# Altium project S7CAS-PLEIADES-CARTE-MERE_Pxx.PrjPcb (part 1 of 3)
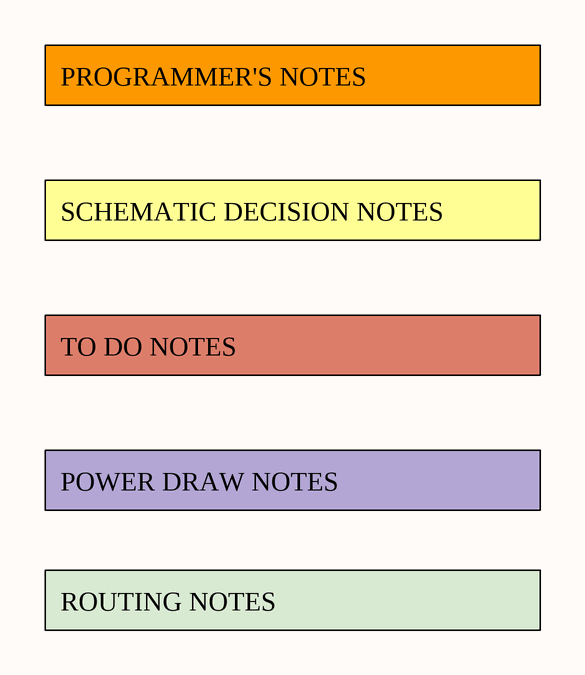
[diagram p0: S7CAS-PLEIADES-CARTE-MERE_Pxx_OVERVIEW.SchDoc]
Project_Date: 2024-01-30; Project_Designer1: Julien Guay; Project_Designer2: Brahim Khalil Tekil; Project_Global: PLEIADES; Project_Group: P15; Project_Name: PLEIADES MOTHERBOARD; Project_Revision: 1.00
11 sheets, 404 parts. Net scope: flat (ports and power ports of the same name join across sheets).
Board file: S7CAS-PLEIADES-CARTE-MERE_Pxx.PcbDoc
Sheets:
  S7CAS-PLEIADES-CARTE-MERE_Pxx_TITLE.SchDoc
  S7CAS-PLEIADES-CARTE-MERE_Pxx_OVERVIEW.SchDoc
  S7CAS-PLEIADES-CARTE-MERE_Pxx_FPGA_bank0_1_5.SchDoc
  S7CAS-PLEIADES-CARTE-MERE_Pxx_DDR.SchDoc
  S7CAS-PLEIADES-CARTE-MERE_Pxx_DEBUG_USB.SchDoc
  S7CAS-PLEIADES-CARTE-MERE_Pxx_PHY.SchDoc
  S7CAS-PLEIADES-CARTE-MERE_Pxx_FLASH_PHY_CLOCK.SchDoc
  S7CAS-PLEIADES-CARTE-MERE_Pxx_CAN.SchDoc
  S7CAS-PLEIADES-CARTE-MERE_Pxx_IO_SENSOR.SchDoc
  S7CAS-PLEIADES-CARTE-MERE_Pxx_ARBRE_CAP_ARBRE.SchDoc
  S7CAS-PLEIADES-CARTE-MERE_TO_BE_DELETED.SchDoc

## Sheet S7CAS-PLEIADES-CARTE-MERE_Pxx_TITLE.SchDoc
size Tabloid; SheetNumber: 1; SheetTotal: 15; Sheet_Name: PLEIADES MOTHERBOARD; Size: 11x17

### Notes on the sheet
- Revision history
- Package size conversion
- Metric
- 1005
- 1608
- Imperial
- 0402
- 0603
- Revision
- 2012
- 3216
- 0805
- 1206
- 3225
- 6432
- 1210
- 2512
- Date :
- Project Title
- Global Project
- Size
- Group
- Date
- Sheet
- of
- Filename
- Designers

## Sheet S7CAS-PLEIADES-CARTE-MERE_Pxx_OVERVIEW.SchDoc
size Tabloid; SheetNumber: 2; SheetTotal: 18; Sheet_Name: OVERVIEW; Size: 11x17

### Notes on the sheet
- PROGRAMMER'S NOTES
- SCHEMATIC DECISION NOTES
- TO DO NOTES
- POWER DRAW NOTES
- ROUTING NOTES
- Sheet Name
- Project Title
- Global Project
- Size
- Group
- Revision
- Date
- Sheet
- of
- Filename
- Designers

## Sheet S7CAS-PLEIADES-CARTE-MERE_Pxx_FPGA_bank0_1_5.SchDoc
size Tabloid; Date: Date; Author: Author 1; Revision: 1; SheetNumber: 3; SheetTotal: 18; Size: 11x17; Sheet_Name: BANK 0, 1 & 5
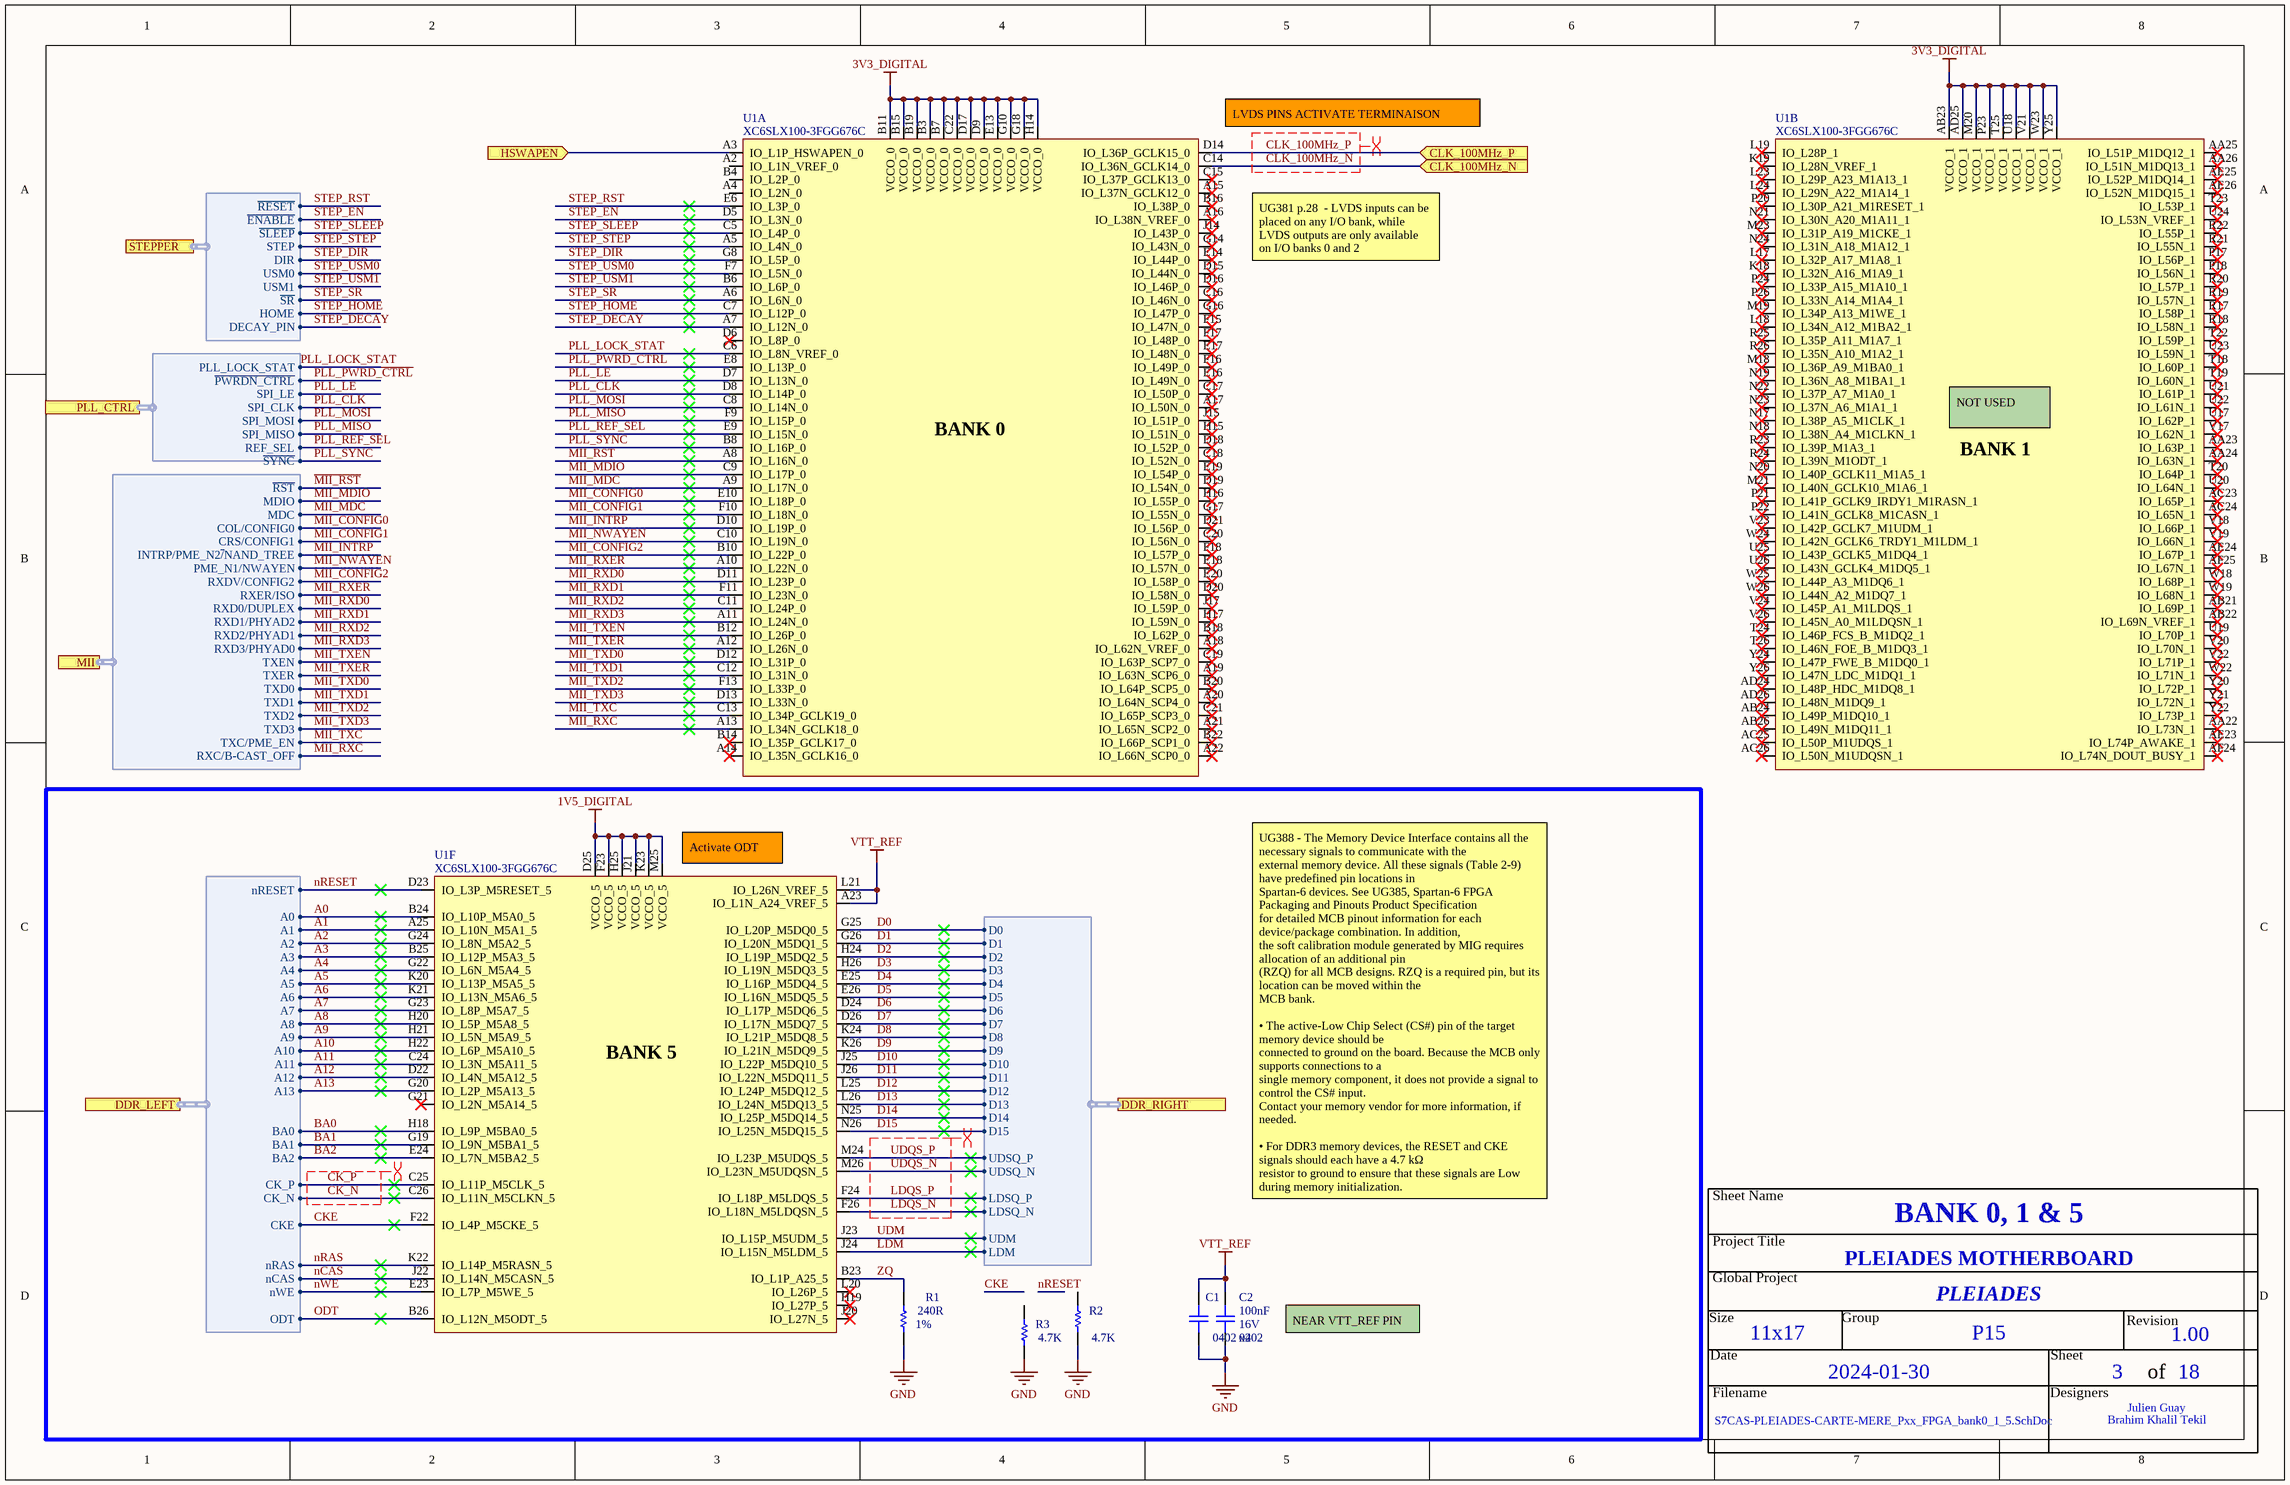
[diagram p1: S7CAS-PLEIADES-CARTE-MERE_Pxx_FPGA_bank0_1_5.SchDoc]

### Parts
C1  0402  [CAP_0402]
C2  value 100nF  Voltage: 16V  [CAP_0402]  (hidden comment: 0402)
R1  value 240R  Precision: 1%  [RES_0402]  (hidden comment: RES - 0603)
R2  value 4.7K  [RES_0402]  (hidden comment: RES - 0603)
R3  value 4.7K  [RES_0402]  (hidden comment: RES - 0603)
U1  XC6SLX100-3FGG676C  [FPGA_XILINX_FGG676]  (parts A,B,F of 10)

### Blocks framed on the sheet
x2: C1 C2 R1-R3 U1

### Ports
CLK_100MHz_N (in, see S7CAS-PLEIADES-CARTE-MERE_Pxx_FLASH_PHY_CLOCK[5A]), CLK_100MHz_P (in, see S7CAS-PLEIADES-CARTE-MERE_Pxx_FLASH_PHY_CLOCK[5A]), DDR_LEFT (harness ddr_left, see S7CAS-PLEIADES-CARTE-MERE_Pxx_DDR[1B]), DDR_RIGHT (harness ddr_right, see S7CAS-PLEIADES-CARTE-MERE_Pxx_DDR[4B]), HSWAPEN (in, see S7CAS-PLEIADES-CARTE-MERE_Pxx_FPGA_bank2_4[1D]), MII (harness MII - Harness, see S7CAS-PLEIADES-CARTE-MERE_Pxx_PHY[1C]), PLL_CTRL (harness PLL_CTRL, see S7CAS-PLEIADES-CARTE-MERE_Pxx_FLASH_PHY_CLOCK[2B]), STEPPER (harness STEPPER_MOTOR_DRIVER_HARNESS, see S7CAS-PLEIADES-CARTE-MERE_Pxx_MOTEUR[4B])

### Harnesses
ddr_left: ODT, nRAS, nCAS, nWE, CKE, CK_P, CK_N, BA0, BA1, BA2, A0, A1, A2, A3, A4, A5, A6, A7, A8, A9, A10, A11, A12, A13, nRESET
ddr_right: D0, D1, D2, D3, D4, D5, D6, D7, D8, D9, D10, D11, D12, D13, D14, D15, UDSQ_P, UDSQ_N, LDSQ_N, LDSQ_P, UDM, LDM
MII - Harness: ~{RST}, MDIO, MDC, COL/CONFIG0, CRS/CONFIG1, INTRP/PME_N2~{/}NAND_TREE, PME_N1/NWAYEN, RXDV/CONFIG2, RXER/ISO, RXD0/DUPLEX, RXD1/PHYAD2, RXD2/PHYAD1, RXD3/PHYAD0, RXC/B-CAST_OFF, TXEN, TXER, TXD0, TXD1, TXD2, TXD3, TXC/PME_EN
PLL_CTRL: ~{PWRDN_CTRL}, SPI_LE, SPI_CLK, SPI_MOSI, SPI_MISO, REF_SEL, ~{SYNC}, PLL_LOCK_STAT
STEPPER_MOTOR_DRIVER_HARNESS: ~{RESET}, ~{ENABLE}, ~{SLEEP}, STEP, DIR, USM0, USM1, ~{SR}, HOME, DECAY_PIN

### Nets
1V5_DIGITAL: U1.D25(VCCO_5) U1.F23(VCCO_5) U1.H25(VCCO_5) U1.J21(VCCO_5) U1.K23(VCCO_5) U1.M25(VCCO_5)
3V3_DIGITAL: U1.AB23(VCCO_1) U1.AD25(VCCO_1) U1.B3(VCCO_0) U1.B7(VCCO_0) U1.B11(VCCO_0) U1.B15(VCCO_0) U1.B19(VCCO_0) U1.C22(VCCO_0) U1.D9(VCCO_0) U1.D17(VCCO_0) U1.E13(VCCO_0) U1.G10(VCCO_0) U1.G18(VCCO_0) U1.H14(VCCO_0) U1.M20(VCCO_1) U1.P23(VCCO_1) U1.T25(VCCO_1) U1.U18(VCCO_1) U1.V21(VCCO_1) U1.W23(VCCO_1) U1.Y25(VCCO_1)
GND: C1.1 C2.1 R1.1 R2.1 R3.1
VTT_REF: C1.2 C2.2 U1.A23(IO_L1N_A24_VREF_5) U1.L21(IO_L26N_VREF_5)
~{MII_RST}: U1.A8(IO_L16N_0) ; port MII.~{RST}
~{PLL_PWRD_CTRL}: U1.E8(IO_L13P_0) ; port PLL_CTRL.~{PWRDN_CTRL}
~{PLL_SYNC}: U1.B8(IO_L16P_0) ; port PLL_CTRL.~{SYNC}
~{STEP_EN}: U1.D5(IO_L3N_0) ; port STEPPER.~{ENABLE}
~{STEP_SR}: U1.A6(IO_L6N_0) ; port STEPPER.~{SR}
A0: U1.B24(IO_L10P_M5A0_5) ; port DDR_LEFT.A0
A1: U1.A25(IO_L10N_M5A1_5) ; port DDR_LEFT.A1
A2: U1.G24(IO_L8N_M5A2_5) ; port DDR_LEFT.A2
A3: U1.B25(IO_L12P_M5A3_5) ; port DDR_LEFT.A3
A4: U1.G22(IO_L6N_M5A4_5) ; port DDR_LEFT.A4
A5: U1.K20(IO_L13P_M5A5_5) ; port DDR_LEFT.A5
A6: U1.K21(IO_L13N_M5A6_5) ; port DDR_LEFT.A6
A7: U1.G23(IO_L8P_M5A7_5) ; port DDR_LEFT.A7
A8: U1.H20(IO_L5P_M5A8_5) ; port DDR_LEFT.A8
A9: U1.H21(IO_L5N_M5A9_5) ; port DDR_LEFT.A9
A10: U1.H22(IO_L6P_M5A10_5) ; port DDR_LEFT.A10
A11: U1.C24(IO_L3N_M5A11_5) ; port DDR_LEFT.A11
A12: U1.D22(IO_L4N_M5A12_5) ; port DDR_LEFT.A12
A13: U1.G20(IO_L2P_M5A13_5) ; port DDR_LEFT.A13
BA0: U1.H18(IO_L9P_M5BA0_5) ; port DDR_LEFT.BA0
BA1: U1.G19(IO_L9N_M5BA1_5) ; port DDR_LEFT.BA1
BA2: U1.E24(IO_L7N_M5BA2_5) ; port DDR_LEFT.BA2
CK_N: U1.C26(IO_L11N_M5CLKN_5) ; port DDR_LEFT.CK_N
CK_P: U1.C25(IO_L11P_M5CLK_5) ; port DDR_LEFT.CK_P
CKE: U1.F22(IO_L4P_M5CKE_5) ; port DDR_LEFT.CKE
CLK_100MHz_N: U1.C14(IO_L36N_GCLK14_0) ; port CLK_100MHz_N
CLK_100MHz_P: U1.D14(IO_L36P_GCLK15_0) ; port CLK_100MHz_P
D0: U1.G25(IO_L20P_M5DQ0_5) ; port DDR_RIGHT.D0
D1: U1.G26(IO_L20N_M5DQ1_5) ; port DDR_RIGHT.D1
D2: U1.H24(IO_L19P_M5DQ2_5) ; port DDR_RIGHT.D2
D3: U1.H26(IO_L19N_M5DQ3_5) ; port DDR_RIGHT.D3
D4: U1.E25(IO_L16P_M5DQ4_5) ; port DDR_RIGHT.D4
D5: U1.E26(IO_L16N_M5DQ5_5) ; port DDR_RIGHT.D5
D6: U1.D24(IO_L17P_M5DQ6_5) ; port DDR_RIGHT.D6
D7: U1.D26(IO_L17N_M5DQ7_5) ; port DDR_RIGHT.D7
D8: U1.K24(IO_L21P_M5DQ8_5) ; port DDR_RIGHT.D8
D9: U1.K26(IO_L21N_M5DQ9_5) ; port DDR_RIGHT.D9
D10: U1.J25(IO_L22P_M5DQ10_5) ; port DDR_RIGHT.D10
D11: U1.J26(IO_L22N_M5DQ11_5) ; port DDR_RIGHT.D11
D12: U1.L25(IO_L24P_M5DQ12_5) ; port DDR_RIGHT.D12
D13: U1.L26(IO_L24N_M5DQ13_5) ; port DDR_RIGHT.D13
D14: U1.N25(IO_L25P_M5DQ14_5) ; port DDR_RIGHT.D14
D15: U1.N26(IO_L25N_M5DQ15_5) ; port DDR_RIGHT.D15
HSWAPEN: U1.A3(IO_L1P_HSWAPEN_0) ; port HSWAPEN
LDM: U1.J24(IO_L15N_M5LDM_5) ; port DDR_RIGHT.LDM
LDQS_N: U1.F26(IO_L18N_M5LDQSN_5) ; port DDR_RIGHT.LDSQ_N
LDQS_P: U1.F24(IO_L18P_M5LDQS_5) ; port DDR_RIGHT.LDSQ_P
MII_CONFIG0: U1.E10(IO_L18P_0) ; port MII.COL/CONFIG0  [project net COL]
MII_CONFIG1: U1.F10(IO_L18N_0) ; port MII.CRS/CONFIG1  [project net CRS]
MII_CONFIG2: U1.B10(IO_L22P_0) ; port MII.RXDV/CONFIG2
MII_INTRP: U1.D10(IO_L19P_0) ; port MII.INTRP/PME_N2~{/}NAND_TREE  [project net INTRP]
MII_MDC: U1.A9(IO_L17N_0) ; port MII.MDC  [project net MDC]
MII_MDIO: U1.C9(IO_L17P_0) ; port MII.MDIO  [project net MDIO]
MII_NWAYEN: U1.C10(IO_L19N_0) ; port MII.PME_N1/NWAYEN
MII_RXC: U1.A13(IO_L34N_GCLK18_0) ; port MII.RXC/B-CAST_OFF
MII_RXD0: U1.D11(IO_L23P_0) ; port MII.RXD0/DUPLEX
MII_RXD1: U1.F11(IO_L23N_0) ; port MII.RXD1/PHYAD2
MII_RXD2: U1.C11(IO_L24P_0) ; port MII.RXD2/PHYAD1
MII_RXD3: U1.A11(IO_L24N_0) ; port MII.RXD3/PHYAD0
MII_RXER: U1.A10(IO_L22N_0) ; port MII.RXER/ISO
MII_TXC: U1.C13(IO_L34P_GCLK19_0) ; port MII.TXC/PME_EN
MII_TXD0: U1.D12(IO_L31P_0) ; port MII.TXD0
MII_TXD1: U1.C12(IO_L31N_0) ; port MII.TXD1
MII_TXD2: U1.F13(IO_L33P_0) ; port MII.TXD2
MII_TXD3: U1.D13(IO_L33N_0) ; port MII.TXD3
MII_TXEN: U1.B12(IO_L26P_0) ; port MII.TXEN
MII_TXER: U1.A12(IO_L26N_0) ; port MII.TXER
nCAS: U1.J22(IO_L14N_M5CASN_5) ; port DDR_LEFT.nCAS
nRAS: U1.K22(IO_L14P_M5RASN_5) ; port DDR_LEFT.nRAS
nRESET: U1.D23(IO_L3P_M5RESET_5) ; port DDR_LEFT.nRESET
nWE: U1.E23(IO_L7P_M5WE_5) ; port DDR_LEFT.nWE
ODT: U1.B26(IO_L12N_M5ODT_5) ; port DDR_LEFT.ODT
PLL_CLK: U1.D8(IO_L14P_0) ; port PLL_CTRL.SPI_CLK
PLL_LE: U1.D7(IO_L13N_0) ; port PLL_CTRL.SPI_LE
PLL_LOCK_STAT: U1.C6(IO_L8N_VREF_0) ; port PLL_CTRL.PLL_LOCK_STAT
PLL_MISO: U1.F9(IO_L15P_0) ; port PLL_CTRL.SPI_MISO
PLL_MOSI: U1.C8(IO_L14N_0) ; port PLL_CTRL.SPI_MOSI
PLL_REF_SEL: U1.E9(IO_L15N_0) ; port PLL_CTRL.REF_SEL
STEP_DECAY: U1.A7(IO_L12N_0) ; port STEPPER.DECAY_PIN
STEP_DIR: U1.G8(IO_L5P_0) ; port STEPPER.DIR
STEP_HOME: U1.C7(IO_L12P_0) ; port STEPPER.HOME
STEP_RST: U1.E6(IO_L3P_0) ; port STEPPER.~{RESET}
STEP_SLEEP: U1.C5(IO_L4P_0) ; port STEPPER.~{SLEEP}
STEP_STEP: U1.A5(IO_L4N_0) ; port STEPPER.STEP
STEP_USM0: U1.F7(IO_L5N_0) ; port STEPPER.USM0
STEP_USM1: U1.B6(IO_L6P_0) ; port STEPPER.USM1
UDM: U1.J23(IO_L15P_M5UDM_5) ; port DDR_RIGHT.UDM
UDQS_N: U1.M26(IO_L23N_M5UDQSN_5) ; port DDR_RIGHT.UDSQ_N
UDQS_P: U1.M24(IO_L23P_M5UDQS_5) ; port DDR_RIGHT.UDSQ_P
ZQ: R1.2 U1.B23(IO_L1P_A25_5)

Not connected (* = marked no-connect by the designer): R2 2; R3 2; U1 A2(IO_L1N_VREF_0) A4(IO_L2N_0) A14(IO_L35N_GCLK16_0)* A15(IO_L37N_GCLK12_0)* A16(IO_L38N_VREF_0)* A17(IO_L50N_0)* A18(IO_L62N_VREF_0)* A19(IO_L63N_SCP6_0)* A20(IO_L64N_SCP4_0)* A21(IO_L65N_SCP2_0)* A22(IO_L66N_SCP0_0)* AA22(IO_L73N_1)* AA23(IO_L63P_1)* AA24(IO_L63N_1)* AA25(IO_L51P_M1DQ12_1)* AA26(IO_L51N_M1DQ13_1)* AB21(IO_L69P_1)* AB22(IO_L69N_VREF_1)* AB24(IO_L49P_M1DQ10_1)* AB26(IO_L49N_M1DQ11_1)* AC23(IO_L65P_1)* AC24(IO_L65N_1)* AC25(IO_L50P_M1UDQS_1)* AC26(IO_L50N_M1UDQSN_1)* AD24(IO_L48P_HDC_M1DQ8_1)* AD26(IO_L48N_M1DQ9_1)* AE23(IO_L74P_AWAKE_1)* AE24(IO_L67P_1)* AE25(IO_L52P_M1DQ14_1)* AE26(IO_L52N_M1DQ15_1)* AF24(IO_L74N_DOUT_BUSY_1)* AF25(IO_L67N_1)* B4(IO_L2P_0) B14(IO_L35P_GCLK17_0)* B16(IO_L38P_0)* B18(IO_L62P_0)* B20(IO_L64P_SCP5_0)* B22(IO_L66P_SCP1_0)* C15(IO_L37P_GCLK13_0)* C16(IO_L46N_0)* C17(IO_L50P_0)* C18(IO_L52N_0)* C19(IO_L63P_SCP7_0)* C20(IO_L56N_0)* C21(IO_L65P_SCP3_0)* D6(IO_L8P_0)* D15(IO_L44N_0)* D16(IO_L46P_0)* D18(IO_L52P_0)* D19(IO_L54N_0)* D20(IO_L58N_0)* D21(IO_L56P_0)* E14(IO_L44P_0)* E16(IO_L49N_0)* E17(IO_L48N_0)* E18(IO_L57N_0)* E19(IO_L54P_0)* E20(IO_L58P_0)* F15(IO_L47N_0)* F16(IO_L49P_0)* F17(IO_L48P_0)* F18(IO_L57P_0)* G14(IO_L43N_0)* G16(IO_L47P_0)* G17(IO_L55N_0)* G21(IO_L2N_M5A14_5)* H15(IO_L51N_0)* H16(IO_L55P_0)* H17(IO_L59N_0)* H19(IO_L27P_5)* J14(IO_L43P_0)* J15(IO_L51P_0)* J17(IO_L59P_0)* J20(IO_L27N_5)* K18(IO_L32N_A16_M1A9_1)* K19(IO_L28N_VREF_1)* L17(IO_L32P_A17_M1A8_1)* L18(IO_L34N_A12_M1BA2_1)* L19(IO_L28P_1)* L20(IO_L26P_5)* L23(IO_L29P_A23_M1A13_1)* L24(IO_L29N_A22_M1A14_1)* M18(IO_L36P_A9_M1BA0_1)* M19(IO_L34P_A13_M1WE_1)* M21(IO_L40N_GCLK10_M1A6_1)* M23(IO_L31P_A19_M1CKE_1)* N17(IO_L38P_A5_M1CLK_1)* N18(IO_L38N_A4_M1CLKN_1)* N19(IO_L36N_A8_M1BA1_1)* N20(IO_L40P_GCLK11_M1A5_1)* N21(IO_L30N_A20_M1A11_1)* N22(IO_L37P_A7_M1A0_1)* N23(IO_L37N_A6_M1A1_1)* N24(IO_L31N_A18_M1A12_1)* P17(IO_L56P_1)* P18(IO_L56N_1)* P20(IO_L30P_A21_M1RESET_1)* P21(IO_L41P_GCLK9_IRDY1_M1RASN_1)* P22(IO_L41N_GCLK8_M1CASN_1)* P24(IO_L33P_A15_M1A10_1)* P26(IO_L33N_A14_M1A4_1)* R17(IO_L58P_1)* R18(IO_L58N_1)* R19(IO_L57N_1)* R20(IO_L57P_1)* R21(IO_L55N_1)* R22(IO_L55P_1)* R23(IO_L39P_M1A3_1)* R24(IO_L39N_M1ODT_1)* R25(IO_L35P_A11_M1A7_1)* R26(IO_L35N_A10_M1A2_1)* T18(IO_L60P_1)* T19(IO_L60N_1)* T20(IO_L64P_1)* T22(IO_L59P_1)* T23(IO_L53P_1)* T24(IO_L46P_FCS_B_M1DQ2_1)* T26(IO_L46N_FOE_B_M1DQ3_1)* U17(IO_L62P_1)* U19(IO_L70P_1)* U20(IO_L64N_1)* U21(IO_L61P_1)* U22(IO_L61N_1)* U23(IO_L59N_1)* U24(IO_L53N_VREF_1)* U25(IO_L43P_GCLK5_M1DQ4_1)* U26(IO_L43N_GCLK4_M1DQ5_1)* V17(IO_L62N_1)* V18(IO_L66P_1)* V19(IO_L66N_1)* V20(IO_L70N_1)* V22(IO_L71P_1)* V23(IO_L42P_GCLK7_M1UDM_1)* V24(IO_L45P_A1_M1LDQS_1)* V26(IO_L45N_A0_M1LDQSN_1)* W18(IO_L68P_1)* W19(IO_L68N_1)* W22(IO_L71N_1)* W24(IO_L42N_GCLK6_TRDY1_M1LDM_1)* W25(IO_L44P_A3_M1DQ6_1)* W26(IO_L44N_A2_M1DQ7_1)* Y20(IO_L72P_1)* Y21(IO_L72N_1)* Y22(IO_L73P_1)* Y24(IO_L47P_FWE_B_M1DQ0_1)* Y26(IO_L47N_LDC_M1DQ1_1)*

### Layout directives
differential pair; differential pair class DDR_CK_PAIR: CK_N, CK_P
differential pair; differential pair class DQS_DIFF_PAIR: LDQS_N, LDQS_P, UDQS_N, UDQS_P
differential pair; differential pair class CLK_100MHz_PAIR: CLK_100MHz_N, CLK_100MHz_P

### Notes on the sheet
- (near U1) LVDS PINS ACTIVATE TERMINAISON
- UG381 p.28  - LVDS inputs can be placed on any I/O bank, while
  LVDS outputs are only available on I/O banks 0 and 2
- (near U1) NOT USED
- (near U1) Activate ODT
- UG388 - The Memory Device Interface contains all the necessary signals to communicate with the
  external memory device. All these signals (Table 2-9) have predefined pin locations in
  Spartan-6 devices. See UG385, Spartan-6 FPGA Packaging and Pinouts Product Specification
  for detailed MCB pinout information for each device/package combination. In addition,
  the soft calibration module generated by MIG requires allocation of an additional pin
  (RZQ) for all MCB designs. RZQ is a required pin, but its location can be moved within the
  MCB bank.
  • The active-Low Chip Select (CS#) pin of the target memory device should be
  connected to ground on the board. Because the MCB only supports connections to a
  single memory component, it does not provide a signal to control the CS# input.
  Contact your memory vendor for more information, if needed.
  • For DDR3 memory devices, the RESET and CKE signals should each have a 4.7 kΩ
  resistor to ground to ensure that these signals are Low during memory initialization.
- NEAR VTT_REF PIN
- Sheet Name
- Project Title
- Global Project
- Revision
- Size
- Date
- Group
- Sheet
- of
- Filename
- Designers
- (in symbol FPGA_XC6SLX100-3FGG676C, part A) BANK 0
- (in symbol FPGA_XC6SLX100-3FGG676C, part B) BANK 1
- (in symbol FPGA_XC6SLX100-3FGG676C, part F) BANK 5

### Library data of the parts
C1 = CAP - 0603: CAP - 0402; Precision: 10%; Voltage: 16V; Value: 100nF; Current: *; CreatedBy: Jonathan Bouchard; Power: *; Package: 0402; Supplier 1: Arrow Electronics; Supplier Part Number 1: CL10B104KO8NNNC
C2 = CAP - 0603: CAP - 0402; Precision: 10%; Current: *; CreatedBy: Jonathan Bouchard; Power: *; Package: 0402; Supplier 1: Arrow Electronics; Supplier Part Number 1: CL10B104KO8NNNC
R1 = RES - 0603: RES - 0402; Current: *; CreatedBy: Jonathan Bouchard; Package: 0402; Supplier 1: Arrow Electronics; Supplier Part Number 1: RMCF0603FT240R
R2 R3 = RES - 0603: RES - 0402; Precision: 1%; Current: *; CreatedBy: Jonathan Bouchard; Package: 0402; Supplier 1: Arrow Electronics; Supplier Part Number 1: RMCF0603FT4K70
U1 = FPGA_XC6SLX100-3FGG676C: FPGA - XILINX SPARTAN 6 480 I/O - BGA-676; Voltage: 1.14 V ~ 1.26 V; Current: *; Power: *; Mfg: Xilinx; Mfg Part Number: XC6SLX100-3FGG676C; HelpURL: https://www.xilinx.com/support/documentation/data_sheets/ds162.pdf; CreatedBy: Jonathan Bouchard; Temperature: 0°C ~ 85°C (TJ); Value: *; Precision: *; Package: BGA-676; Supplier 1: Digikey; Supplier Part Number 1: 122-1760-ND

## Sheet S7CAS-PLEIADES-CARTE-MERE_Pxx_DDR.SchDoc
size Tabloid; SheetNumber: 4; SheetTotal: 18; Sheet_Name: DDR; Size: 11x17
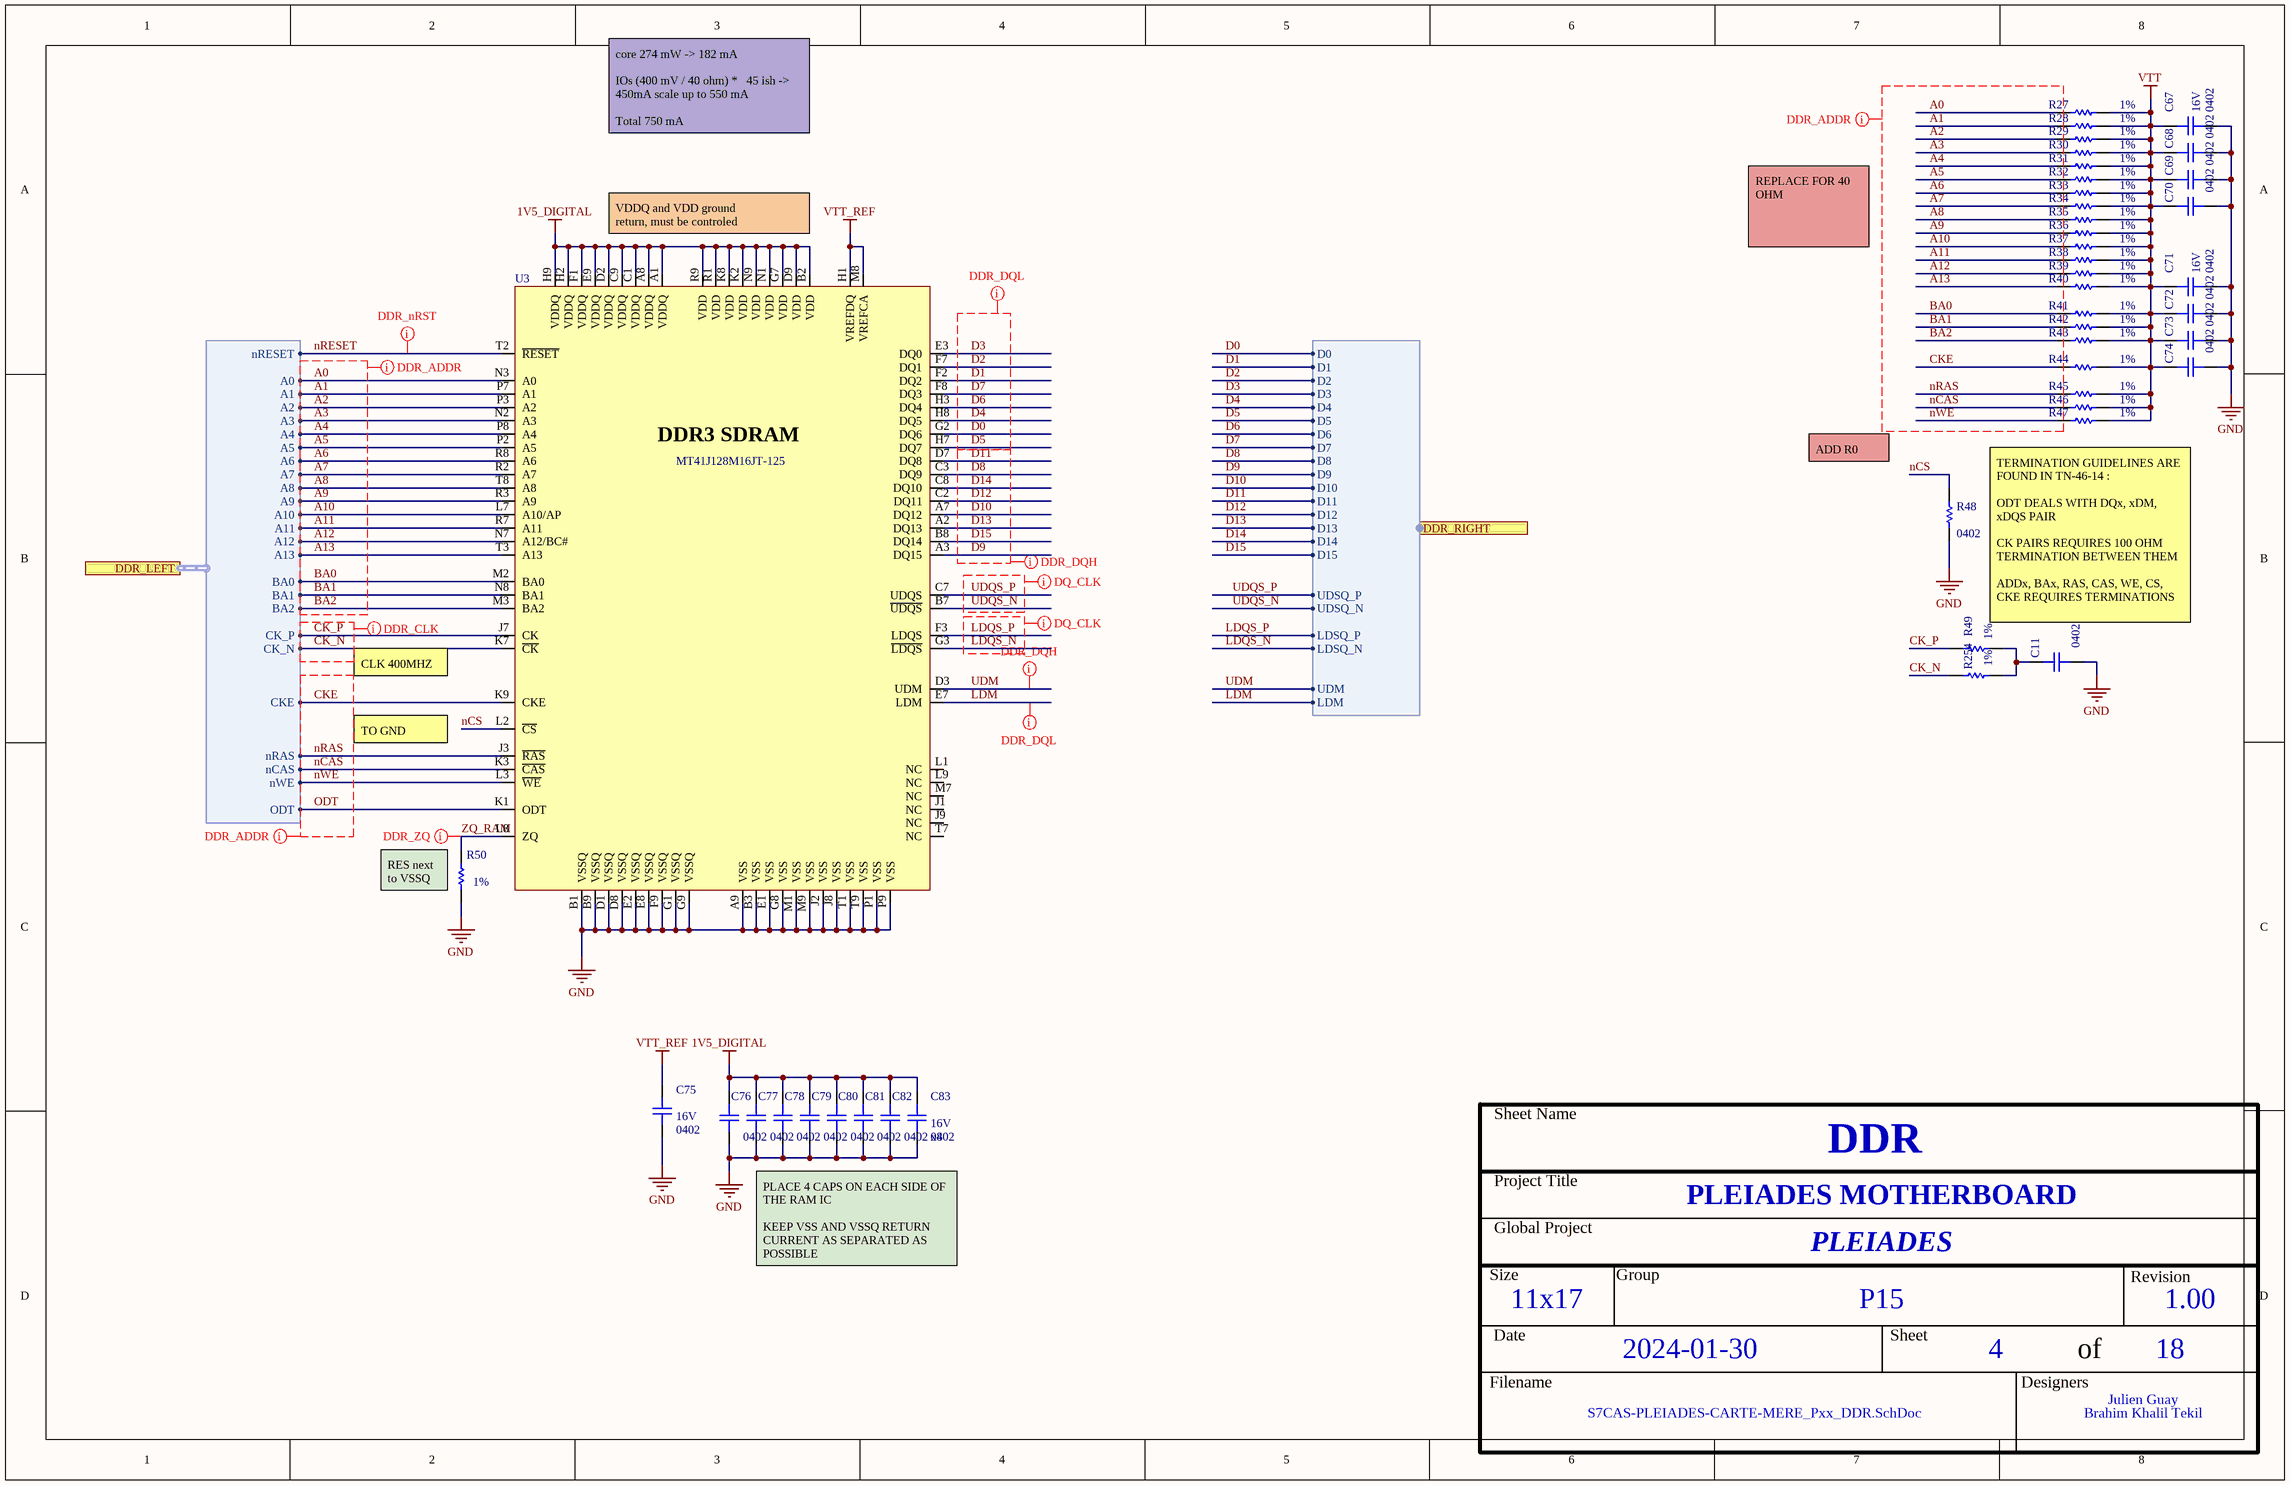
[diagram p2: S7CAS-PLEIADES-CARTE-MERE_Pxx_DDR.SchDoc]

### Parts
C11  0402  [CAP_0402]
C67  Voltage: 16V  [CAP_0402]  (hidden comment: 0402)
C68  0402  [CAP_0402]
C69  0402  [CAP_0402]
C70  0402  [CAP_0402]
C71  Voltage: 16V  [CAP_0402]  (hidden comment: 0402)
C72  0402  [CAP_0402]
C73  0402  [CAP_0402]
C74  0402  [CAP_0402]
C75  Voltage: 16V  [CAP_0402]  (hidden comment: 0402)
C76  0402  [CAP_0402]
C77  0402  [CAP_0402]
C78  0402  [CAP_0402]
C79  0402  [CAP_0402]
C80  0402  [CAP_0402]
C81  0402  [CAP_0402]
C82  0402  [CAP_0402]
C83  Voltage: 16V  [CAP_0402]  (hidden comment: 0402)
R27  Precision: 1%  [RES_0402]  (hidden comment: RES - 0603)
R28  Precision: 1%  [RES_0402]  (hidden comment: RES - 0603)
R29  Precision: 1%  [RES_0402]  (hidden comment: RES - 0603)
R30  Precision: 1%  [RES_0402]  (hidden comment: RES - 0603)
R31  Precision: 1%  [RES_0402]  (hidden comment: RES - 0603)
R32  Precision: 1%  [RES_0402]  (hidden comment: RES - 0603)
R33  Precision: 1%  [RES_0402]  (hidden comment: RES - 0603)
R34  Precision: 1%  [RES_0402]  (hidden comment: RES - 0603)
R35  Precision: 1%  [RES_0402]  (hidden comment: RES - 0603)
R36  Precision: 1%  [RES_0402]  (hidden comment: RES - 0603)
R37  Precision: 1%  [RES_0402]  (hidden comment: RES - 0603)
R38  Precision: 1%  [RES_0402]  (hidden comment: RES - 0603)
R39  Precision: 1%  [RES_0402]  (hidden comment: RES - 0603)
R40  Precision: 1%  [RES_0402]  (hidden comment: RES - 0603)
R41  Precision: 1%  [RES_0402]  (hidden comment: RES - 0603)
R42  Precision: 1%  [RES_0402]  (hidden comment: RES - 0603)
R43  Precision: 1%  [RES_0402]  (hidden comment: RES - 0603)
R44  Precision: 1%  [RES_0402]  (hidden comment: RES - 0603)
R45  Precision: 1%  [RES_0402]  (hidden comment: RES - 0603)
R46  Precision: 1%  [RES_0402]  (hidden comment: RES - 0603)
R47  Precision: 1%  [RES_0402]  (hidden comment: RES - 0603)
R48  Package: 0402  [RES_0402]  (hidden comment: RES - 0603)
R49  Precision: 1%  [RES_0402]  (hidden comment: RES - 0603)
R50  Precision: 1%  [RES_0402]  (hidden comment: RES - 0603)
R254  Precision: 1%  [RES_0402]  (hidden comment: RES - 0603)
U3  MT41J128M16JT-125  [MEM_DDR3_MT41J128M16JT-125]

### Ports
DDR_LEFT (harness ddr_left, see S7CAS-PLEIADES-CARTE-MERE_Pxx_FPGA_bank0_1_5[1C]), DDR_RIGHT (harness ddr_right, see S7CAS-PLEIADES-CARTE-MERE_Pxx_FPGA_bank0_1_5[3C])

### Harnesses
ddr_left: ODT, nRAS, nCAS, nWE, CKE, CK_P, CK_N, BA0, BA1, BA2, A0, A1, A2, A3, A4, A5, A6, A7, A8, A9, A10, A11, A12, A13, nRESET
ddr_right: D0, D1, D2, D3, D4, D5, D6, D7, D8, D9, D10, D11, D12, D13, D14, D15, UDSQ_P, UDSQ_N, LDSQ_N, LDSQ_P, UDM, LDM

### Nets
1V5_DIGITAL: C76.2 C77.2 C78.2 C79.2 C80.2 C81.2 C82.2 C83.2 U3.A1(VDDQ) U3.A8(VDDQ) U3.B2(VDD) U3.C1(VDDQ) U3.C9(VDDQ) U3.D2(VDDQ) U3.D9(VDD) U3.E9(VDDQ) U3.F1(VDDQ) U3.G7(VDD) U3.H2(VDDQ) U3.H9(VDDQ) U3.K2(VDD) U3.K8(VDD) U3.N1(VDD) U3.N9(VDD) U3.R1(VDD) U3.R9(VDD)
GND: C11.1 C67.1 C68.1 C69.1 C70.1 C71.1 C72.1 C73.1 C74.1 C75.1 C76.1 C77.1 C78.1 C79.1 C80.1 C81.1 C82.1 C83.1 R48.1 R50.1 U3.A9(VSS) U3.B1(VSSQ) U3.B3(VSS) U3.B9(VSSQ) U3.D1(VSSQ) U3.D8(VSSQ) U3.E1(VSS) U3.E2(VSSQ) U3.E8(VSSQ) U3.F9(VSSQ) U3.G1(VSSQ) U3.G8(VSS) U3.G9(VSSQ) U3.J2(VSS) U3.J8(VSS) U3.M1(VSS) U3.M9(VSS) U3.P1(VSS) U3.P9(VSS) U3.T1(VSS) U3.T9(VSS)
VTT: C67.2 C68.2 C69.2 C70.2 C71.2 C72.2 C73.2 C74.2 R27.1 R28.1 R29.1 R30.1 R31.1 R32.1 R33.1 R34.1 R35.1 R36.1 R37.1 R38.1 R39.1 R40.1 R41.1 R42.1 R43.1 R44.1 R45.1 R46.1 R47.1
VTT_REF: C75.2 U3.H1(VREFDQ) U3.M8(VREFCA)
A0: R27.2 U3.N3(A0) ; port DDR_LEFT.A0
A1: R28.2 U3.P7(A1) ; port DDR_LEFT.A1
A2: R29.2 U3.P3(A2) ; port DDR_LEFT.A2
A3: R30.2 U3.N2(A3) ; port DDR_LEFT.A3
A4: R31.2 U3.P8(A4) ; port DDR_LEFT.A4
A5: R32.2 U3.P2(A5) ; port DDR_LEFT.A5
A6: R33.2 U3.R8(A6) ; port DDR_LEFT.A6
A7: R34.2 U3.R2(A7) ; port DDR_LEFT.A7
A8: R35.2 U3.T8(A8) ; port DDR_LEFT.A8
A9: R36.2 U3.R3(A9) ; port DDR_LEFT.A9
A10: R37.2 U3.L7(A10/AP) ; port DDR_LEFT.A10
A11: R38.2 U3.R7(A11) ; port DDR_LEFT.A11
A12: R39.2 U3.N7(A12/BC#) ; port DDR_LEFT.A12
A13: R40.2 U3.T3(A13) ; port DDR_LEFT.A13
BA0: R41.2 U3.M2(BA0) ; port DDR_LEFT.BA0
BA1: R42.2 U3.N8(BA1) ; port DDR_LEFT.BA1
BA2: R43.2 U3.M3(BA2) ; port DDR_LEFT.BA2
CK_N: R254.2 U3.K7(~{CK}) ; port DDR_LEFT.CK_N
CK_P: R49.2 U3.J7(CK) ; port DDR_LEFT.CK_P
CKE: R44.2 U3.K9(CKE) ; port DDR_LEFT.CKE
D0: U3.G2(DQ6) ; port DDR_RIGHT.D0
D1: U3.F2(DQ2) ; port DDR_RIGHT.D1
D2: U3.F7(DQ1) ; port DDR_RIGHT.D2
D3: U3.E3(DQ0) ; port DDR_RIGHT.D3
D4: U3.H8(DQ5) ; port DDR_RIGHT.D4
D5: U3.H7(DQ7) ; port DDR_RIGHT.D5
D6: U3.H3(DQ4) ; port DDR_RIGHT.D6
D7: U3.F8(DQ3) ; port DDR_RIGHT.D7
D8: U3.C3(DQ9) ; port DDR_RIGHT.D8
D9: U3.A3(DQ15) ; port DDR_RIGHT.D9
D10: U3.A7(DQ12) ; port DDR_RIGHT.D10
D11: U3.D7(DQ8) ; port DDR_RIGHT.D11
D12: U3.C2(DQ11) ; port DDR_RIGHT.D12
D13: U3.A2(DQ13) ; port DDR_RIGHT.D13
D14: U3.C8(DQ10) ; port DDR_RIGHT.D14
D15: U3.B8(DQ14) ; port DDR_RIGHT.D15
LDM: U3.E7(LDM) ; port DDR_RIGHT.LDM
LDQS_N: U3.G3(~{LDQS}) ; port DDR_RIGHT.LDSQ_N
LDQS_P: U3.F3(LDQS) ; port DDR_RIGHT.LDSQ_P
nCAS: R46.2 U3.K3(~{CAS}) ; port DDR_LEFT.nCAS
nCS: R48.2 U3.L2(~{CS})
nRAS: R45.2 U3.J3(~{RAS}) ; port DDR_LEFT.nRAS
nRESET: U3.T2(~{RESET}) ; port DDR_LEFT.nRESET
nWE: R47.2 U3.L3(~{WE}) ; port DDR_LEFT.nWE
ODT: U3.K1(ODT) ; port DDR_LEFT.ODT
UDM: U3.D3(UDM) ; port DDR_RIGHT.UDM
UDQS_N: U3.B7(~{UDQS}) ; port DDR_RIGHT.UDSQ_N
UDQS_P: U3.C7(UDQS) ; port DDR_RIGHT.UDSQ_P
ZQ_RAM: R50.2 U3.L8(ZQ)
NetC11_2: C11.2 R49.1 R254.1

Not connected (* = marked no-connect by the designer): U3 J1(NC) J9(NC) L1(NC) L9(NC) M7(NC) T7(NC)

### Layout directives
net class DDR_ADDR; net class DDR_40OHM: A0, A1, A2, A3, A4, A5, A6, A7, A8, A9, A10, A11, A12, A13, BA0, BA1, BA2, CKE, nCAS, nRAS, nWE, ODT
net class DDR_DQL; net class DDR_40OHM: D0, D1, D2, D3, D4, D5, D6, D7, LDM
net class DDR_DQH; net class DDR_40OHM: D8, D9, D10, D11, D12, D13, D14, D15, UDM
differential pair; differential pair class DDR_CLK_DIFF_PAIR; differential pair class DDR_DIFF; net class DDR_40OHM; net class DDR_CLK: CK_N, CK_P
differential pair; differential pair class DQH_CLK_DIFF_PAIR; net class DDR_DQH; differential pair class DDR_DIFF: UDQS_N, UDQS_P
differential pair; differential pair class DQL_CLK_DIFF_PAIR; net class DDR_DQL; differential pair class DDR_DIFF: LDQS_N, LDQS_P
net class DDR_ADDR: A0, A1, A2, A3, A4, A5, A6, A7, A8, A9, A10, A11, A12, A13, BA0, BA1, BA2, CKE, nCAS, nRAS, nWE
net class DDR_40OHM: nRESET, ZQ_RAM

### Notes on the sheet
- core 274 mW -> 182 mA
  IOs (400 mV / 40 ohm) *   45 ish -> 450mA scale up to 550 mA
  Total 750 mA
- VDDQ and VDD ground
  return, must be controled
- REPLACE FOR 40 OHM
- ADD R0
- TERMINATION GUIDELINES ARE FOUND IN TN-46-14 :
  ODT DEALS WITH DQx, xDM, xDQS PAIR
  CK PAIRS REQUIRES 100 OHM TERMINATION BETWEEN THEM
  ADDx, BAx, RAS, CAS, WE, CS, CKE REQUIRES TERMINATIONS
- CLK 400MHZ
- TO GND
- (near R50) RES next to VSSQ
- (near C83) x8
- PLACE 4 CAPS ON EACH SIDE OF THE RAM IC
  KEEP VSS AND VSSQ RETURN CURRENT AS SEPARATED AS POSSIBLE
- Sheet Name
- Project Title
- Global Project
- Size
- Group
- Revision
- Date
- Sheet
- of
- Filename
- Designers
- (in symbol MEM_DDR3_MT41J128M16JT-125:K TR) DDR3 SDRAM

### Library data of the parts
C11 C68-C70 C72-C74 C76-C82 = CAP - 0603: CAP - 0402; Precision: 10%; Voltage: 16V; Current: *; CreatedBy: Jonathan Bouchard; Power: *; Package: 0402; Supplier 1: Arrow Electronics; Supplier Part Number 1: CL10B104KO8NNNC; Parameter 1: *
C67 C71 C75 C83 = CAP - 0603: CAP - 0402; Precision: 10%; Current: *; CreatedBy: Jonathan Bouchard; Power: *; Package: 0402; Supplier 1: Arrow Electronics; Supplier Part Number 1: CL10B104KO8NNNC; Parameter 1: *
R27-R47 R49 R50 R254 = RES - 0603: RES - 0402; Current: *; CreatedBy: Jonathan Bouchard; Package: 0402; Supplier 1: Arrow Electronics; Parameter 1: *
  R27-R47: Supplier Part Number 1: RMCF0603FT30R0
  R49 R254: Supplier Part Number 1: RMCF0603FT100R
  R50: Supplier Part Number 1: RMCF0603FT240R
R48 = RES - 0603: RES - 0402; Precision: 1%; Current: *; CreatedBy: Jonathan Bouchard; Supplier 1: Arrow Electronics; Supplier Part Number 1: RMCF0603ZT0R00; Parameter 1: *
U3 = MEM_DDR3_MT41J128M16JT-125:K TR: MEM - DDR3 SDRAM 2GBIT 800MHZ - TFBGA-96; Voltage: 1.425 V ~ 1.575 V; Mfg: Micrel; Current: *; Power: *; Mfg Part Number: MT41J128M16JT-125; HelpURL: http://www.micron.com/~/media/Documents/Products/Data%20Sheet/DRAM/DDR3/2Gb_DDR3_SDRAM.pdf; CreatedBy: Jonathan Bouchard; Temperature: 0°C ~ 95°C (TC); Precision: *; Package: TFBGA-96; Supplier 1: Digikey; Supplier Part Number 1: 557-1611-1-ND; Parameter 1: *

## Sheet S7CAS-PLEIADES-CARTE-MERE_Pxx_DEBUG_USB.SchDoc
size Tabloid; SheetNumber: 8; SheetTotal: 18; Sheet_Name: DEBUG_USB; Size: 11x17
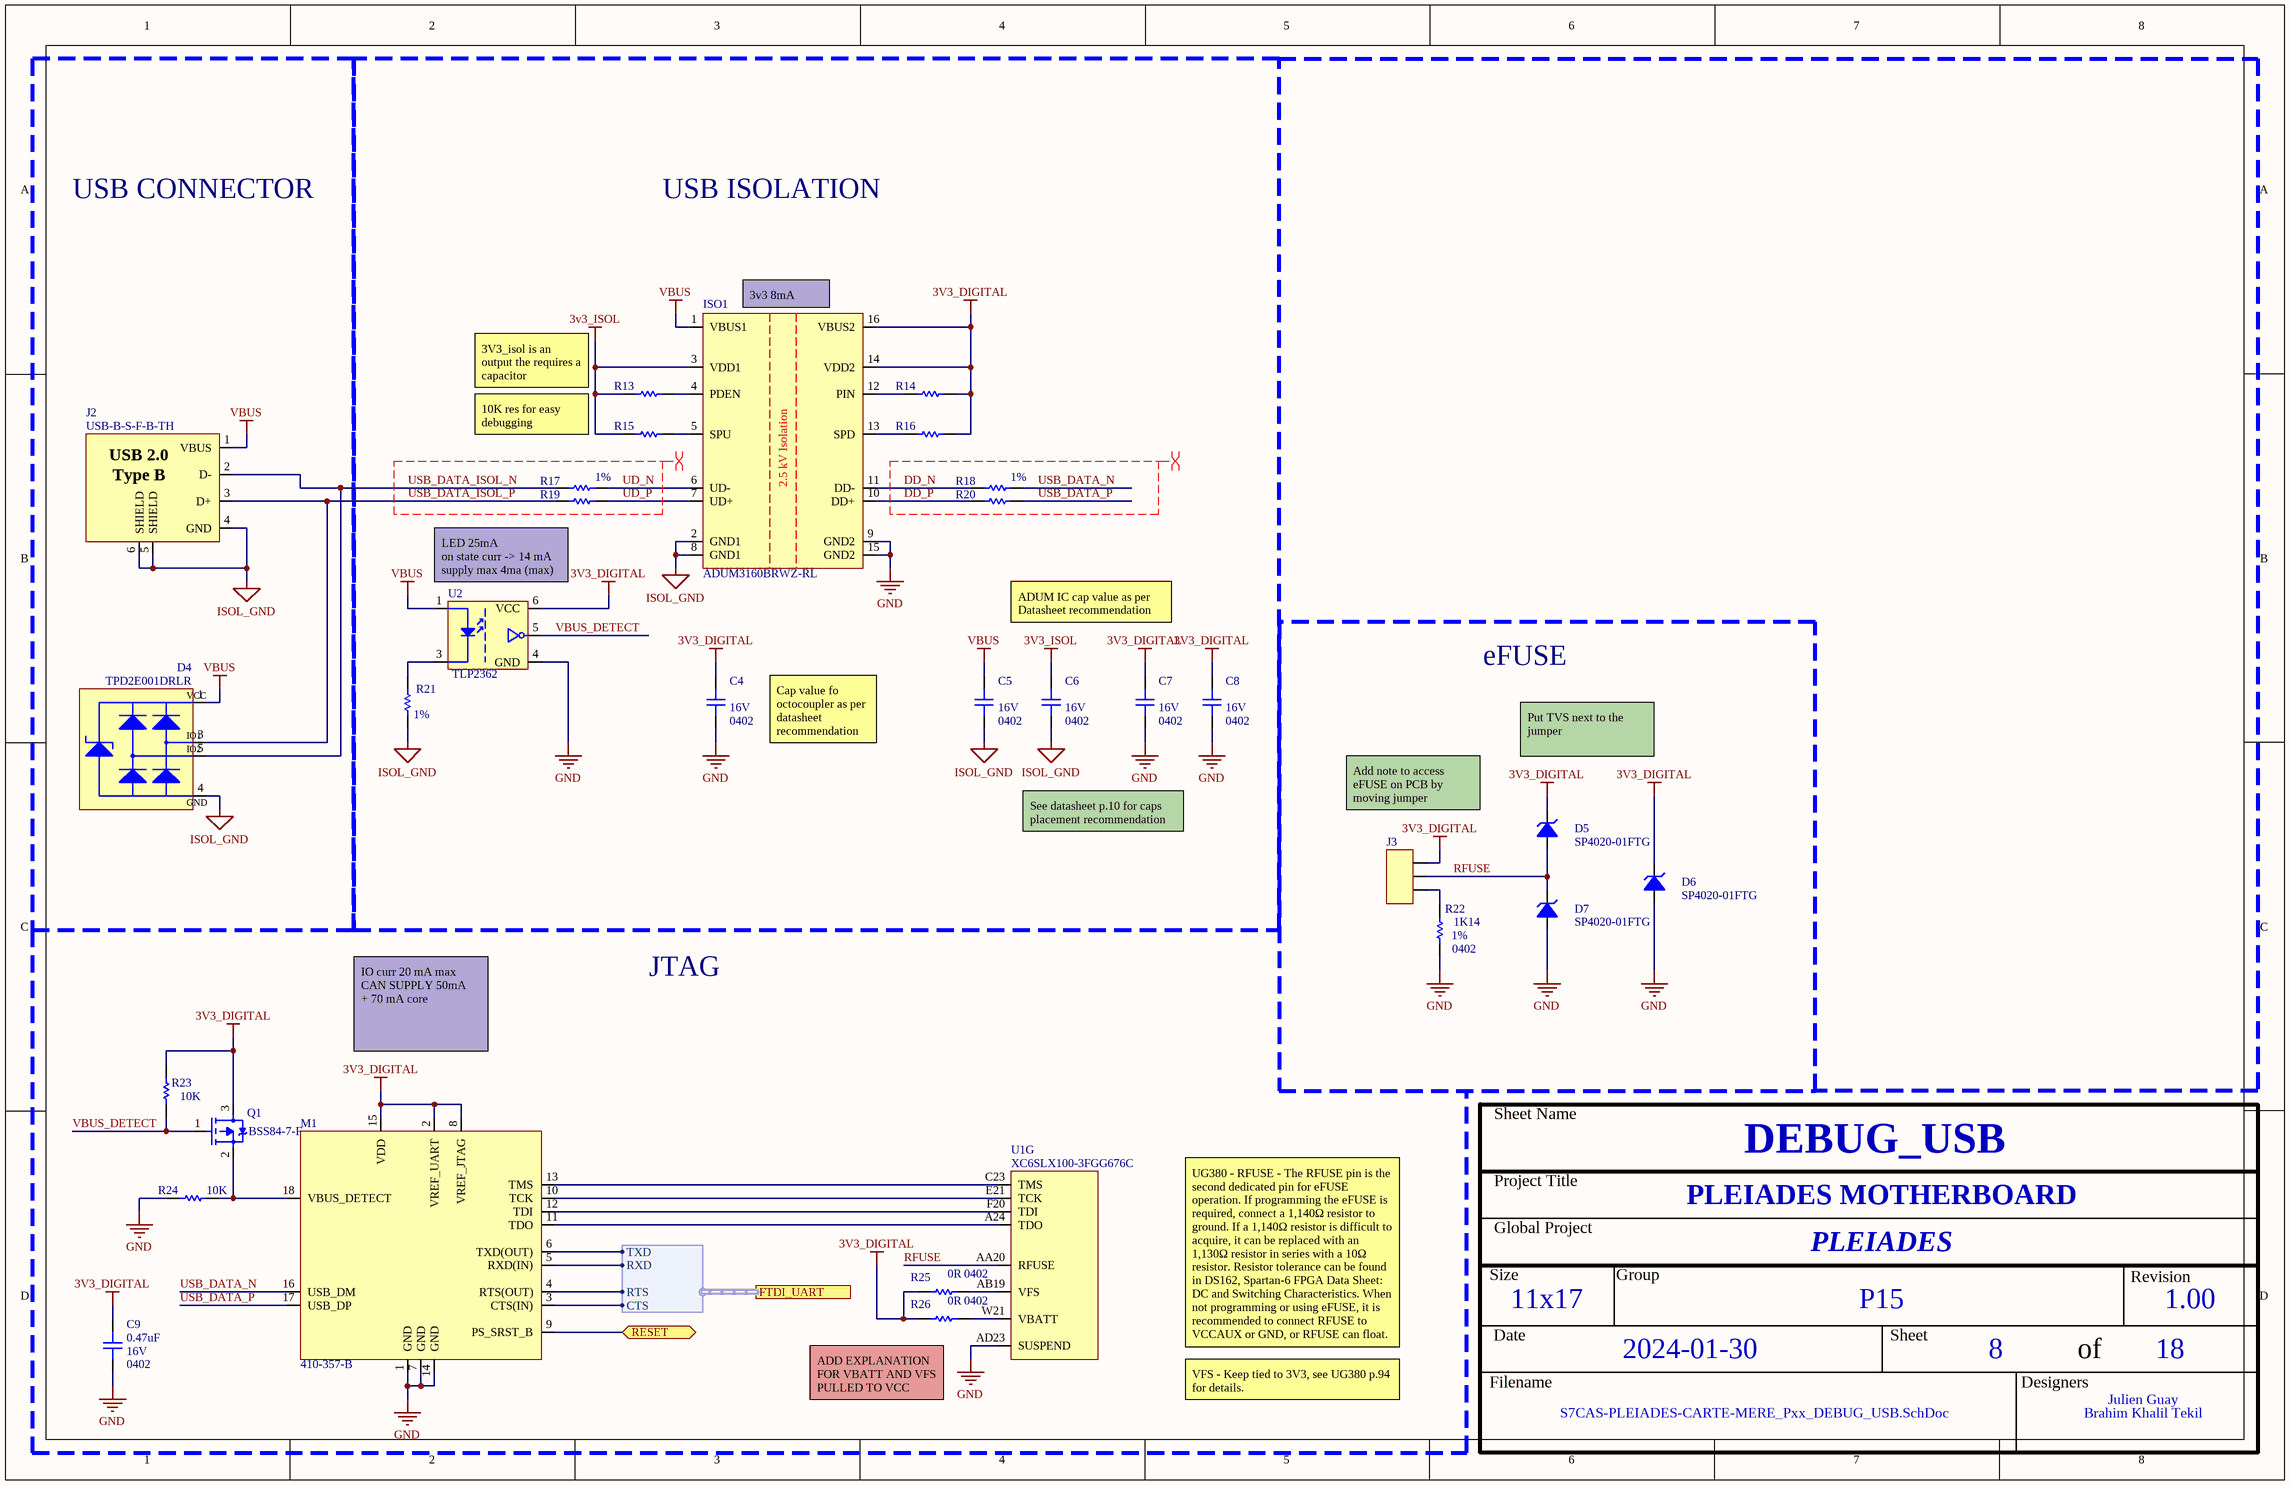
[diagram p3: S7CAS-PLEIADES-CARTE-MERE_Pxx_DEBUG_USB.SchDoc]

### Parts
C4  Voltage: 16V  [CAP_0402]  (hidden comment: 0402)
C5  Voltage: 16V  [CAP_0402]  (hidden comment: 0402)
C6  Voltage: 16V  [CAP_0402]  (hidden comment: 0402)
C7  Voltage: 16V  [CAP_0402]  (hidden comment: 0402)
C8  Voltage: 16V  [CAP_0402]  (hidden comment: 0402)
C9  value 0.47uF  Voltage: 16V  [CAP_0402]  (hidden comment: 0402)
D4  TPD2E001DRLR  [TVS_USB_TPD2E001DRLR]
D5  SP4020-01FTG  [SOD323 - UNIDIR]
D6  SP4020-01FTG  [SOD323 - UNIDIR]
D7  SP4020-01FTG  [SOD323 - UNIDIR]
ISO1  ADUM3160BRWZ-RL  [ISO_ADUM3160BRWZ-RL]
J2  USB-B-S-F-B-TH  [CON_USB_USB-B-S-F-B-TH]
J3  Part Number  [MALE HEADER - 1x3 2.54mm]  (value not drawn)
M1  410-357-B  [MOD_JTAG_410-357-B]
Q1  BSS84-7-F  [SOT23-3]
R13  RES - 0603  [RES_0402]  (value not drawn)
R14  RES - 0603  [RES_0402]  (value not drawn)
R15  RES - 0603  [RES_0402]  (value not drawn)
R16  RES - 0603  [RES_0402]  (value not drawn)
R17  Precision: 1%  [RES_0402]  (hidden comment: RES - 0402)
R18  Precision: 1%  [RES_0402]  (hidden comment: RES - 0402)
R19  RES - 0402  [RES_0402]  (value not drawn)
R20  RES - 0402  [RES_0402]  (value not drawn)
R21  Precision: 1%  [RES_0402]  (hidden comment: RES - 0603)
R22  value 1K14  Package: 0402  Precision: 1%  [RES_0402]  (hidden comment: RES - 0402)
R23  value 10K  [RES_0402]  (hidden comment: RES - 0603)
R24  value 10K  [RES_0402]  (hidden comment: RES - 0603)
R25  value 0R  Package: 0402  [RES_0402]  (hidden comment: RES - 0603)
R26  value 0R  Package: 0402  [RES_0402]  (hidden comment: RES - 0603)
U1  XC6SLX100-3FGG676C  [FPGA_XILINX_FGG676]  (part G of 10)
U2  TLP2362  [OPTO_TLP2362]

### Blocks framed on the sheet
USB CONNECTOR: D4 J2
USB ISOLATION: C4-C8 ISO1 R13-R21 U2
eFUSE: D5-D7 J3 R22

### Ports
FTDI_UART (harness FTDI_HARNESS, see S7CAS-PLEIADES-CARTE-MERE_Pxx_FPGA_bank2_4[6A]), RESET (bidir, see S7CAS-PLEIADES-CARTE-MERE_Pxx_FPGA_bank2_4[6C])

### Harnesses
FTDI_HARNESS: TXD, RXD, RTS, CTS

### Nets
3V3_DIGITAL: C4.2 C7.2 C8.2 C9.2 D5.1 D6.1 ISO1.14(VDD2) ISO1.16(VBUS2) J3.1 M1.2(VREF_UART) M1.8(VREF_JTAG) M1.15(VDD) Q1.3 R14.1 R16.1 R23.2 R25.2 R26.2 U2.6(VCC)
3v3_ISOL: C6.2 ISO1.3(VDD1) R13.2 R15.2
GND: C4.1 C7.1 C8.1 C9.1 D6.2 D7.2 ISO1.9(GND2) ISO1.15(GND2) M1.1(GND) M1.7(GND) M1.14(GND) R22.1 R24.1 U1.AD23(SUSPEND) U2.4(GND)
ISOL_GND: C5.1 C6.1 D4.4(GND) ISO1.2(GND1) ISO1.8(GND1) J2.4(GND) J2.5(SHIELD) J2.6(SHIELD) R21.1
VBUS: C5.2 D4.1(VCC) ISO1.1(VBUS1) J2.1(VBUS) U2.1
DD_N: ISO1.11(DD-) R18.2
DD_P: ISO1.10(DD+) R20.2
RESET: M1.9(PS_SRST_B) ; port RESET
RFUSE: D5.2 D7.1 J3.2 U1.AA20(RFUSE)
UD_N: ISO1.6(UD-) R17.1
UD_P: ISO1.7(UD+) R19.1
USB_DATA_ISOL_N: D4.5(IO2) J2.2(D-) R17.2
USB_DATA_ISOL_P: D4.3(IO1) J2.3(D+) R19.2
USB_DATA_N: M1.16(USB_DM) R18.1
USB_DATA_P: M1.17(USB_DP) R20.1
VBUS_DETECT: Q1.1 R23.1 U2.5(vout)
NetISO1_4: ISO1.4(PDEN) R13.1
NetISO1_5: ISO1.5(SPU) R15.1
NetISO1_12: ISO1.12(PIN) R14.2
NetISO1_13: ISO1.13(SPD) R16.2
NetJ3_3: J3.3 R22.2
NetM1_3: M1.3(CTS(IN)) ; port FTDI_UART.CTS
NetM1_4: M1.4(RTS(OUT)) ; port FTDI_UART.RTS
NetM1_5: M1.5(RXD(IN)) ; port FTDI_UART.RXD
NetM1_6: M1.6(TXD(OUT)) ; port FTDI_UART.TXD
NetM1_10: M1.10(TCK) U1.E21(TCK)
NetM1_11: M1.11(TDO) U1.A24(TDO)
NetM1_12: M1.12(TDI) U1.F20(TDI)
NetM1_13: M1.13(TMS) U1.C23(TMS)
NetM1_18: M1.18(VBUS_DETECT) Q1.2 R24.2
NetR21_2: R21.2 U2.3
NetR25_1: R25.1 U1.AB19(VFS)
NetR26_1: R26.1 U1.W21(VBATT)

Not connected (* = marked no-connect by the designer): D4 2(NC)

### Layout directives
differential pair; differential pair class USB_DATA_PAIR; differential pair class USB_90OHM: UD_N, UD_P, USB_DATA_ISOL_N, USB_DATA_ISOL_P
differential pair; differential pair class USB_90OHM: DD_N, DD_P, USB_DATA_N, USB_DATA_P

### Notes on the sheet
- (near ISO1) 3v3 8mA
- 3V3_isol is an output the requires a capacitor
- 10K res for easy debugging
- LED 25mA
  on state curr -> 14 mA
  supply max 4ma (max)
- ADUM IC cap value as per Datasheet recommendation
- Cap value fo octocoupler as per datasheet recommendation
- Put TVS next to the jumper
- See datasheet p.10 for caps placement recommendation
- Add note to access eFUSE on PCB by moving jumper
- JTAG
- IO curr 20 mA max
  CAN SUPPLY 50mA
  + 70 mA core
- UG380 - RFUSE - The RFUSE pin is the second dedicated pin for eFUSE operation. If programming the eFUSE is required, connect a 1,140Ω resistor to ground. If a 1,140Ω resistor is difficult to acquire, it can be replaced with an 1,130Ω resistor in series with a 10Ω resistor. Resistor tolerance can be found in DS162, Spartan-6 FPGA Data Sheet: DC and Switching Characteristics. When not programming or using eFUSE, it is recommended to connect RFUSE to VCCAUX or GND, or RFUSE can float.
- (near R26) ADD EXPLANATION FOR VBATT AND VFS PULLED TO VCC
- VFS - Keep tied to 3V3, see UG380 p.94 for details.
- Sheet Name
- Project Title
- Global Project
- Size
- Group
- Revision
- Date
- Sheet
- of
- Filename
- Designers
- (in symbol CON_USB_USB-B-S-F-B-TH) USB 2.0; Type B
- (in symbol ISO_ADUM3160BRWZ-RL) 2.5 kV Isolation

### Library data of the parts
C4-C9 = CAP - 0603: CAP - 0402; Precision: 10%; Current: *; CreatedBy: Jonathan Bouchard; Power: *; Package: 0402; Supplier 1: Arrow Electronics
  C4: Supplier Part Number 1: CL10B104KO8NNNC; Parameter 1: *
  C5-C8: Supplier Part Number 1: C1608X7R1C474K080AC; Parameter 1: *
  C9: Supplier Part Number 1: C1608X7R1C474K080AC
D4 = TVS_USB_TPD2E001DRLR: TVS - USB TVS DIODE 5.5V - SOT-553; Manufacturer #1: Texas Instruments; Voltage Rating: 5.5V (Max); GRAMS Lib Spec: 2.8; Magnetic Material: YES; Cryo: UNKNOWN; Tolerance: *; Current Rating: *; Power Max: *; HelpURL: http://www.ti.com/lit/ds/symlink/tpd2e001.pdf; CreatedBy/Date: Jonathan Bouchard 2018-07-10; VerifiedBy: Arnaud Samson 16-07-18; Temperature: -40°C ~ 85°C (TA); Package: SOT-553; Manufacturer #2: *; Note: *; Assembly Type: SMD; Part Number #2: *; Part Number #1: TPD2E001DRLR; Polarized: YES; Supplier 1: Digi-Key; Supplier Part Number 1: 296-21883-1-ND; Parameter 1: *
D5-D7 = TVS_SP4020-01FTG: TVS - 3.3VWM 21.8V (Typ) Clamp 30A (8/20µs) Ipp Tvs Diode Surface Mount SOD-323; GRAMS Lib Spec: 2.7; Supplier 1: Future Electronics; Supplier Part Number 1: 6058247
ISO1 = ISO_ADUM3160BRWZ-RL: ISO - DGTL ISO 2.5KV 2CH USB - 16SOIC; Manufacturer #1: Analog Devices; Voltage Rating: 3~5.5V; GRAMS Lib Spec: 2.8; Magnetic Material: UNKNOWN; Polarized: Yes; Tolerance: *; Current Rating: *; Power Max: *; HelpURL: https://www.analog.com/media/en/technical-documentation/data-sheets/ADuM3160.pdf; CreatedBy/Date: Tommy Rossignol 2018-11-16; VerifiedBy: Caroline Paulin - 13 février 2019; Temperature: -40°C ~ 105°C; Package: 16-SOIC; Manufacturer #2: *; Assembly Type: SMD; Part Number #2: *; Part Number #1: ADUM3160BRWZ-RL; Supplier 1: Digi-Key; Supplier Part Number 1: ADUM3160BRWZ-RLCT-ND; Cryo: UNKNOWN; Parameter 1: *
J2 = CON_USB_USB-B-S-F-B-TH: CON - USB B RECPT TH R/A - 4-TH; Manufacturer #1: Samtec Inc.; Voltage Rating: 30VAC; GRAMS Lib Spec: 2.8c; Magnetic Material: UNKNOWN; Polarized: YES; Tolerance: *; Current Rating: *; Power Max: *; HelpURL: http://suddendocs.samtec.com/catalog_english/usb_b.pdf; CreatedBy/Date: Jonathan Bouchard 2020-03-24; VerifiedBy: C.Paulin - 22/04/2020; Temperature: -50°C ~ 85°C; Package: 4-TH; Manufacturer #2: *; Note: *; Assembly Type: TH; Part Number #2: *; Part Number #1: USB-B-S-F-B-TH; Supplier 1: Digi-Key; Supplier Part Number 1: SAM10867-ND; Cryo: UNKNOWN; Parameter 1: *
J3 = MALE HEADER - 1x3 2.54mm: MALE HEADER - 2.54mm 1x2; GRAMS Lib Spec: 2.7
M1 = MOD_JTAG_410-357-B: MOD - JTAG-SMT3-NC Programming Module For Xilinx FPGA - 18-SMT; Manufacturer #1: Digilent; Voltage Rating: VDD: 2.97V~3.63V, VJTAG/VUART: 1.65V~5.5V; GRAMS Lib Spec: 2.8; Note: Prior to reflow, the JTAG-SMT3-NC module must be dried at 125°C for 17 hours; Magnetic Material: Unknown; Polarized: Yes; Value: *; Tolerance: *; Current Rating: *; Power Max: *; HelpURL: https://reference.digilentinc.com/_media/reference/programmers/jtag-smt3/jtag-smt3-nc_rm.pdf; CreatedBy/Date: Tommy Rossignol 2018-11-23; VerifiedBy: Nicolas V. (2019-01-28); Temperature: -40°C ~ 85°C; Package: 18-pad SMT; Manufacturer #2: *; Assembly Type: SMD; Part Number #2: *; Part Number #1: 410-357-B; Supplier 1: Digi-Key; Supplier Part Number 1: 1286-1196-ND; Cryo: UNKNOWN
Q1 = MOS_P_CHANNEL: P-Channel  Enhancement Mode Field Effect Transistor; Current: [Current]; Mfr: *; Package / Case: *; Vds: *; Rds ON: *; Vgs: *; Operating Temperature: *; Supplier 1: Future Electronics; Supplier Part Number 1: 2984037
R13-R16 R23-R26 = RES - 0603: RES - 0402; Precision: 1%; Current: *; CreatedBy: Jonathan Bouchard; Supplier 1: Arrow Electronics
  R13-R16: Package: 0402; Supplier Part Number 1: RMCF0603FT10K0; Parameter 1: *
  R23 R24: Package: 0402; Supplier Part Number 1: RMCF0603FT10K0
  R25 R26: Supplier Part Number 1: RMCF0603ZT0R00
R17 R18 R22 = RES - 0402: Voltage: 50V; Power: 1/16W; Current: *; CreatedBy: Jonathan Bouchard
  R17 R18: Package: 0402; Supplier 1: Arrow Electronics; Supplier Part Number 1: RC0402FR-0724RL; Parameter 1: *
  R22: Supplier 1: Digikey; Supplier Part Number 1: 2019-RN73H1ETTP1141F50CT-ND
R19 R20 = RES - 0402: Voltage: 50V; Power: 1/16W; Precision: 1%; Current: *; CreatedBy: Jonathan Bouchard; Package: 0402; Supplier 1: Arrow Electronics; Supplier Part Number 1: RC0402FR-0724RL; Parameter 1: *
R21 = RES - 0603: RES - 0402; Current: *; CreatedBy: Jonathan Bouchard; Package: 0402; Supplier 1: Arrow Electronics; Supplier Part Number 1: RMCF0603FT100R; Parameter 1: *
U1 = FPGA_XC6SLX100-3FGG676C: as U1 on sheet S7CAS-PLEIADES-CARTE-MERE_Pxx_FPGA_bank0_1_5; Current: *; Power: *; Mfg: Xilinx; Mfg Part Number: XC6SLX100-3FGG676C; HelpURL: https://www.xilinx.com/support/documentation/data_sheets/ds162.pdf; CreatedBy: Jonathan Bouchard; Temperature: 0°C ~ 85°C (TJ); Value: *; Precision: *; Package: BGA-676; Supplier 1: Digikey; Supplier Part Number 1: 122-1760-ND
U2 = PHOTO_COUP_TLP2362: ISO - Logic Output Optoisolator 10MBd Open Collector 3750Vrms 1 Channel 20kV/µs CMTI 6-SO, 5 Lead; GRAMS Lib Spec: 2.7; Supplier 1: Arrow Electronics; Supplier Part Number 1: TLP2362(TPR,E; Parameter 1: *

## Sheet S7CAS-PLEIADES-CARTE-MERE_Pxx_PHY.SchDoc
size Tabloid; SheetNumber: 9; SheetTotal: 18; Sheet_Name: PHY; Size: 11x17
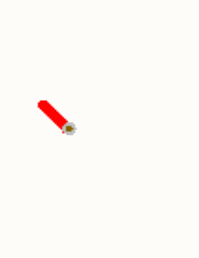
[diagram p4: S7CAS-PLEIADES-CARTE-MERE_Pxx_PHY.SchDoc, left]
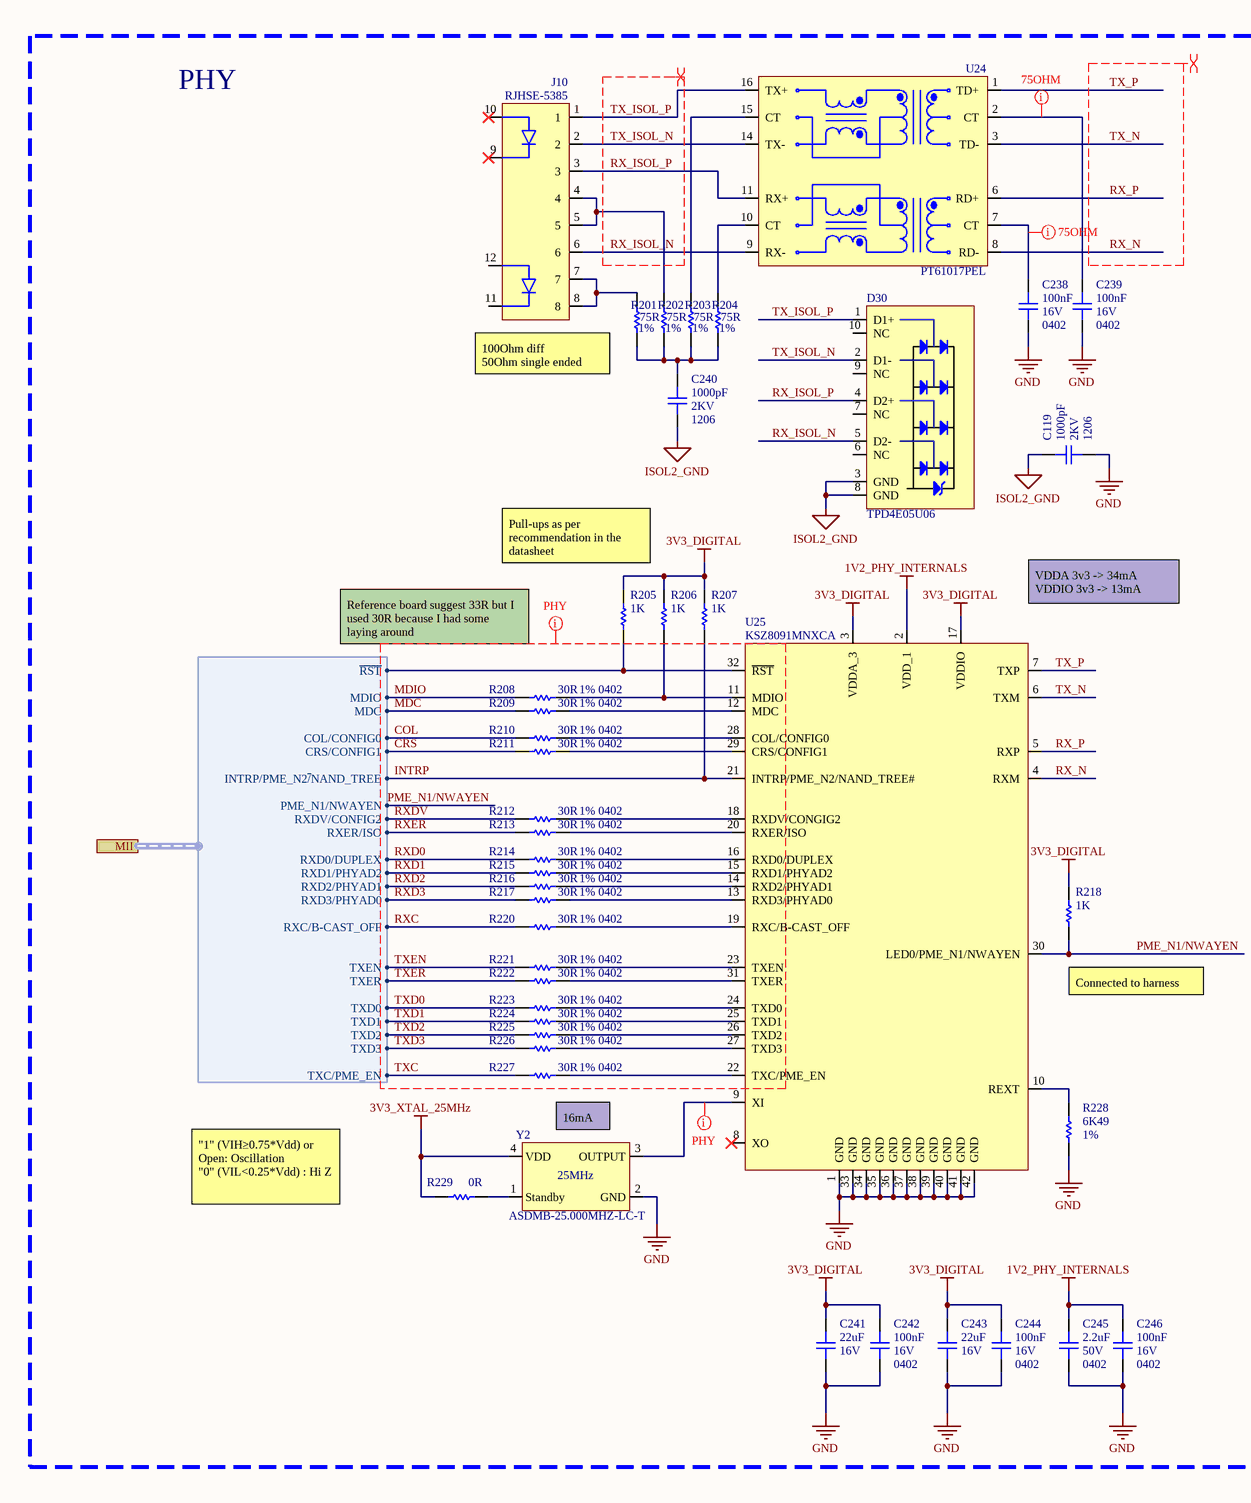
[diagram p5: S7CAS-PLEIADES-CARTE-MERE_Pxx_PHY.SchDoc, middle]
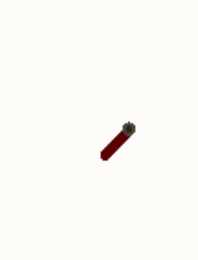
[diagram p6: S7CAS-PLEIADES-CARTE-MERE_Pxx_PHY.SchDoc, right]

### Parts
C119  value 1000pF  Voltage: 2KV  Package: 1206  [CAP_1206]  (hidden comment: CAP - 1206)
C238  value 100nF  Voltage: 16V  [CAP_0402]  (hidden comment: 0402)
C239  value 100nF  Voltage: 16V  [CAP_0402]  (hidden comment: 0402)
C240  value 1000pF  Voltage: 2KV  Package: 1206  [CAP_1206]  (hidden comment: CAP - 1206)
C241  value 22uF  Voltage: 16V  [CAP_1206]  (hidden comment: CAP - 1206)
C242  value 100nF  Voltage: 16V  [CAP_0402]  (hidden comment: 0402)
C243  value 22uF  Voltage: 16V  [CAP_1206]  (hidden comment: CAP - 1206)
C244  value 100nF  Voltage: 16V  [CAP_0402]  (hidden comment: 0402)
C245  value 2.2uF  Voltage: 50V  [CAP_0402]  (hidden comment: 0402)
C246  value 100nF  Voltage: 16V  [CAP_0402]  (hidden comment: 0402)
D30  TPD4E05U06  [TVS_DATA_TPD4E05U06]
J10  RJHSE-5385  [CONN_ETHERNET_RJHSE-5385]
R201  value 75R  Precision: 1%  [RES_0402]  (hidden comment: RES - 0603)
R202  value 75R  Precision: 1%  [RES_0402]  (hidden comment: RES - 0603)
R203  value 75R  Precision: 1%  [RES_0402]  (hidden comment: RES - 0603)
R204  value 75R  Precision: 1%  [RES_0402]  (hidden comment: RES - 0603)
R205  value 1K  [RES_0402]  (hidden comment: RES - 0603)
R206  value 1K  [RES_0402]  (hidden comment: RES - 0603)
R207  value 1K  [RES_0402]  (hidden comment: RES - 0603)
R208  value 30R  Package: 0402  Precision: 1%  [RES_0402]  (hidden comment: RES - 0603)
R209  value 30R  Package: 0402  Precision: 1%  [RES_0402]  (hidden comment: RES - 0603)
R210  value 30R  Package: 0402  Precision: 1%  [RES_0402]  (hidden comment: RES - 0603)
R211  value 30R  Package: 0402  Precision: 1%  [RES_0402]  (hidden comment: RES - 0603)
R212  value 30R  Package: 0402  Precision: 1%  [RES_0402]  (hidden comment: RES - 0603)
R213  value 30R  Package: 0402  Precision: 1%  [RES_0402]  (hidden comment: RES - 0603)
R214  value 30R  Package: 0402  Precision: 1%  [RES_0402]  (hidden comment: RES - 0603)
R215  value 30R  Package: 0402  Precision: 1%  [RES_0402]  (hidden comment: RES - 0603)
R216  value 30R  Package: 0402  Precision: 1%  [RES_0402]  (hidden comment: RES - 0603)
R217  value 30R  Package: 0402  Precision: 1%  [RES_0402]  (hidden comment: RES - 0603)
R218  value 1K  [RES_0402]  (hidden comment: RES - 0603)
R220  value 30R  Package: 0402  Precision: 1%  [RES_0402]  (hidden comment: RES - 0603)
R221  value 30R  Package: 0402  Precision: 1%  [RES_0402]  (hidden comment: RES - 0603)
R222  value 30R  Package: 0402  Precision: 1%  [RES_0402]  (hidden comment: RES - 0603)
R223  value 30R  Package: 0402  Precision: 1%  [RES_0402]  (hidden comment: RES - 0603)
R224  value 30R  Package: 0402  Precision: 1%  [RES_0402]  (hidden comment: RES - 0603)
R225  value 30R  Package: 0402  Precision: 1%  [RES_0402]  (hidden comment: RES - 0603)
R226  value 30R  Package: 0402  Precision: 1%  [RES_0402]  (hidden comment: RES - 0603)
R227  value 30R  Package: 0402  Precision: 1%  [RES_0402]  (hidden comment: RES - 0603)
R228  value 6K49  Precision: 1%  [RES_0402]  (hidden comment: RES - 0402)
R229  value 0R  [RES_0402]  (hidden comment: RES - 0603)
U24  PT61017PEL  [ISO_PT61017PEL]
U25  KSZ8091MNXCA  [COM_ETH_PHY_KSZ8091MNXCA]
Y2  ASDMB-25.000MHZ-LC-T  [OSC_ASDMB-25.000MHZ-LC-T]

### Blocks framed on the sheet
PHY: C119 C238-C246 D30 J10 R201-R218 R220-R229 U24 U25 Y2

### Ports
MII (harness MII - Harness, see S7CAS-PLEIADES-CARTE-MERE_Pxx_FPGA_bank0_1_5[1B])

### Harnesses
MII - Harness: ~{RST}, MDIO, MDC, COL/CONFIG0, CRS/CONFIG1, INTRP/PME_N2~{/}NAND_TREE, PME_N1/NWAYEN, RXDV/CONFIG2, RXER/ISO, RXD0/DUPLEX, RXD1/PHYAD2, RXD2/PHYAD1, RXD3/PHYAD0, RXC/B-CAST_OFF, TXEN, TXER, TXD0, TXD1, TXD2, TXD3, TXC/PME_EN

### Nets
1V2_PHY_INTERNALS: C245.2 C246.2 U25.2(VDD_1)
3V3_DIGITAL: C241.2 C242.2 C243.2 C244.2 R205.2 R206.2 R207.2 R218.2 U25.3(VDDA_3) U25.17(VDDIO)
3V3_XTAL_25MHz: R229.2 Y2.4(VDD)
GND: C119.1 C238.1 C239.1 C241.1 C242.1 C243.1 C244.1 C245.1 C246.1 R228.1 U25.1(GND) U25.33(GND) U25.34(GND) U25.35(GND) U25.36(GND) U25.37(GND) U25.38(GND) U25.39(GND) U25.40(GND) U25.41(GND) U25.42(GND) Y2.2(GND)
ISOL2_GND: C119.2 C240.1 D30.3(GND) D30.8(GND)
~{MII_RST}: R205.1 U25.32(~{RST}) ; port MII.~{RST}
COL: R210.1 ; port MII.COL/CONFIG0
CRS: R211.1 ; port MII.CRS/CONFIG1
INTRP: R207.1 U25.21(INTRP/PME_N2/NAND_TREE#) ; port MII.INTRP/PME_N2~{/}NAND_TREE
MDC: R209.1 ; port MII.MDC
MDIO: R208.1 ; port MII.MDIO
PME_N1/NWAYEN: R218.1 U25.30(LED0/PME_N1/NWAYEN) ; port MII.PME_N1/NWAYEN  [project net MII_NWAYEN]
RX_ISOL_N: D30.5(D2-) J10.6 U24.9(RX-)
RX_ISOL_P: D30.4(D2+) J10.3 U24.11(RX+)
RX_N: U24.8(RD-) U25.4(RXM)
RX_P: U24.6(RD+) U25.5(RXP)
RXC: R220.1 ; port MII.RXC/B-CAST_OFF  [project net MII_RXC]
RXD0: R214.1 ; port MII.RXD0/DUPLEX  [project net MII_RXD0]
RXD1: R215.1 ; port MII.RXD1/PHYAD2  [project net MII_RXD1]
RXD2: R216.1 ; port MII.RXD2/PHYAD1  [project net MII_RXD2]
RXD3: R217.1 ; port MII.RXD3/PHYAD0  [project net MII_RXD3]
RXDV: R212.1 ; port MII.RXDV/CONFIG2  [project net MII_CONFIG2]
RXER: R213.1 ; port MII.RXER/ISO  [project net MII_RXER]
TX_ISOL_N: D30.2(D1-) J10.2 U24.14(TX-)
TX_ISOL_P: D30.1(D1+) J10.1 U24.16(TX+)
TX_N: U24.3(TD-) U25.6(TXM)
TX_P: U24.1(TD+) U25.7(TXP)
TXC: R227.1 ; port MII.TXC/PME_EN  [project net MII_TXC]
TXD0: R223.1 ; port MII.TXD0  [project net MII_TXD0]
TXD1: R224.1 ; port MII.TXD1  [project net MII_TXD1]
TXD2: R225.1 ; port MII.TXD2  [project net MII_TXD2]
TXD3: R226.1 ; port MII.TXD3  [project net MII_TXD3]
TXEN: R221.1 ; port MII.TXEN  [project net MII_TXEN]
TXER: R222.1 ; port MII.TXER  [project net MII_TXER]
NetC238_2: C238.2 U24.7(CT)
NetC239_2: C239.2 U24.2(CT)
NetC240_2: C240.2 R201.1 R202.1 R203.1 R204.1
NetJ10_4: J10.4 J10.5 R202.2
NetJ10_7: J10.7 J10.8 R201.2
NetR203_2: R203.2 U24.15(CT)
NetR204_2: R204.2 U24.10(CT)
NetR206_1: R206.1 R208.2 U25.11(MDIO)
NetR209_2: R209.2 U25.12(MDC)
NetR210_2: R210.2 U25.28(COL/CONFIG0)
NetR211_2: R211.2 U25.29(CRS/CONFIG1)
NetR212_2: R212.2 U25.18(RXDV/CONGIG2)
NetR213_2: R213.2 U25.20(RXER/ISO)
NetR214_2: R214.2 U25.16(RXD0/DUPLEX)
NetR215_2: R215.2 U25.15(RXD1/PHYAD2)
NetR216_2: R216.2 U25.14(RXD2/PHYAD1)
NetR217_2: R217.2 U25.13(RXD3/PHYAD0)
NetR220_2: R220.2 U25.19(RXC/B-CAST_OFF)
NetR221_2: R221.2 U25.23(TXEN)
NetR222_2: R222.2 U25.31(TXER)
NetR223_2: R223.2 U25.24(TXD0)
NetR224_2: R224.2 U25.25(TXD1)
NetR225_2: R225.2 U25.26(TXD2)
NetR226_2: R226.2 U25.27(TXD3)
NetR227_2: R227.2 U25.22(TXC/PME_EN)
NetR228_2: R228.2 U25.10(REXT)
NetR229_1: R229.1 Y2.1(Standby)
NetU25_9: U25.9(XI) Y2.3(OUTPUT)

Not connected (* = marked no-connect by the designer): D30 6(NC) 7(NC) 9(NC) 10(NC); J10 9(LED1_K)* 10(LED1_A)* 11(LED2_K) 12(LED2_A); U25 8(XO)*

### Layout directives
differential pair; differential pair class ETH_DIFF_PAIR; differential pair class ETH75OHM; net class eth_diff: RX_N, RX_P, TX_N, TX_P
differential pair; differential pair class ETH_ISOL_DIFF_PAIR; differential pair class ETH75OHM; net class eth_diff: RX_ISOL_N, RX_ISOL_P, TX_ISOL_N, TX_ISOL_P
net class MII_TRANSMISSION_LINE: COL, CRS, INTRP, MDC, MDIO, NetU25_9, PME_N1/NWAYEN, RXC, RXD0, RXD1, RXD2, RXD3, RXDV, RXER, TXC, TXD0, TXD1, TXD2, TXD3, TXEN, TXER
net class 75OHM: NetC238_2, NetC239_2

### Notes on the sheet
- 100Ohm diff
  50Ohm single ended
- Pull-ups as per recommendation in the datasheet
- Reference board suggest 33R but I used 30R because I had some laying around
- (near U25) VDDA 3v3 -> 34mA
  VDDIO 3v3 -> 13mA
- Connected to harness
- 16mA
- "1" (VIH≥0.75*Vdd) or Open: Oscillation
  "0" (VIL<0.25*Vdd) : Hi Z
- Sheet Name
- Project Title
- Global Project
- Size
- Group
- Revision
- Date
- Sheet
- of
- Filename
- Designers

### Library data of the parts
C119 C240 C241 C243 = CAP - 1206: Precision: 10%; Current: *; CreatedBy: Jonathan Bouchard; Power: *; Supplier 1: Arrow Electronics
  C119 C240: Supplier Part Number 1: 1206GC102KAT1A
  C241 C243: Package: 1206; Supplier Part Number 1: CL31A226MOCLNNC
C238 C239 C242 C244-C246 = CAP - 0603: CAP - 0402; Precision: 10%; Current: *; CreatedBy: Jonathan Bouchard; Power: *; Package: 0402; Supplier 1: Arrow Electronics
  C238 C239 C242 C244 C246: Supplier Part Number 1: CL10B104KO8NNNC
  C245: Supplier Part Number 1: GRM188R61H225KE11D
D30 = TVS_DATA_TPD4E05U06: TVS - TVS DIODE 5.5VWM 14VC - 10SON; Manufacturer #1: Texas Instruments; Part Number #1: TPD4E05U06DQAR; Current Rating: 2.5A (8/20µs); Power Max: 40 W (peak); Value: 4 unidirectionnal channels; Voltage rating: 6V (Breakdown); Polarized: YES; Magnetic Material: UNKNOWN; GRAMS Lib Spec: 2.8; Manufacturer #2: *; Part Number #2: *; HelpURL: http://www.ti.com/lit/ds/symlink/tpd4e05u06.pdf; Supplier 1: Digi-Key; Supplier Part Number 1: 296-35765-1-ND; Note: *; Assembly Type: SMD; Temperature: -40°C ~ 125°C; Package: 10-USON; CreatedBy/Date: Olivier Bernard / 12/3/2018; Tolerance: *; VerifiedBy: Caroline Paulin / 4 juillet 2018; Cryo: UNKNOWN
J10 = CONN_ETHERNET_RJHSE-5385: CONN - MOD JACK RJ45 R/A ETHERNET - TH; Mfg: Amphenol; Voltage: *; Current: *; Power: *; Mfg Part Number: RJHSE-5385; HelpURL: https://www.amphenolcanada.com/ProductSearch/drawings/AC/RJHSE538X.pdf; CreatedBy: Jonathan Bouchard; Temperature: -55°C ~ 85°C; Value: *; Precision: *; Package: TH-12; Supplier 1: Digikey; Supplier Part Number 1: RJHSE-5385-ND
R201-R204 R208-R217 R220-R227 = RES - 0603: RES - 0402; Current: *; CreatedBy: Jonathan Bouchard; Supplier 1: Arrow Electronics
  R201-R204: Package: 0402; Supplier Part Number 1: RMCF0603FT75R0
  R208-R217 R220-R227: Supplier Part Number 1: RMCF0603FT30R0
R205-R207 R218 R229 = RES - 0603: RES - 0402; Precision: 1%; Current: *; CreatedBy: Jonathan Bouchard; Package: 0402; Supplier 1: Arrow Electronics
  R205-R207 R218: Supplier Part Number 1: RMCF0603FT1K00
  R229: Supplier Part Number 1: RMCF0603ZT0R00
R228 = RES - 0402: Voltage: 50V; Power: 1/16W; Current: *; CreatedBy: Jonathan Bouchard; Package: 0402; Supplier 1: Mouser; Supplier Part Number 1: 652-CR0402-FX6491GLF
U24 = ISO_PT61017PEL: ISO - 350µH LAN 10/100 Base-T Pulse Transformer 1CT:1CT Surface Mount; GRAMS Lib Spec: 2.7; Supplier 1: Arrow Electronics; Supplier Part Number 1: PT61017PEL
U25 = COM_ETH_PHY_KSZ8091MNXCA: COM - ETHERNET PHY 10/100 - QFN-32; Voltage: 1.8V, 2.5V, 3.3V; Mfg: Micrel; Current: *; Power: *; Mfg Part Number: KSZ8091MNXCA; HelpURL: http://ww1.microchip.com/downloads/en/DeviceDoc/00002275A.pdf; CreatedBy: Jonathan Bouchard; Temperature: 0°C ~ 70°C; Value: *; Precision: *; Package: QFN-32; Supplier 1: Digikey; Supplier Part Number 1: 576-4356-ND
Y2 = OSC_ASDMB-25.000MHZ-LC-T: OSC - 25MHz XO (Standard) LVCMOS - 4-SMD, No Lead; Manufacturer #1: Abracon LLC; Tolerance: ±50ppm; Voltage Rating: 1.8V ~ 3.3V; GRAMS Lib Spec: 2.8; Magnetic Material: Unknown; Polarized: Yes; Value: 25MHz; Current Rating: *; Power Max: *; HelpURL: https://abracon.com/Oscillators/ASDMB.pdf; CreatedBy/Date: Joël Lemay 2019-03-29; VerifiedBy: C. Paulin - 29 mai 2019; Temperature: -40°C ~ +85°C; Package: 4-SMD, No Lead; Manufacturer #2: *; Note: *; Assembly Type: SMD; Part Number #2: *; Part Number #1: ASDMB-25.000MHZ-LC-T; Supplier 1: Digi-Key; Supplier Part Number 1: 535-11730-1-ND; Cryo: UNKNOWN